# Altium project COMMS_ECU_revA.PrjPcb (part 3 of 3)

## Sheet LM74910H_PINOUT.SchDoc
size B; SheetNumber: 8; SheetTotal: 12
Used 2 times, as channels OR_0, OR_1. Parts and nets are listed once, with the designators drawn on the sheet.
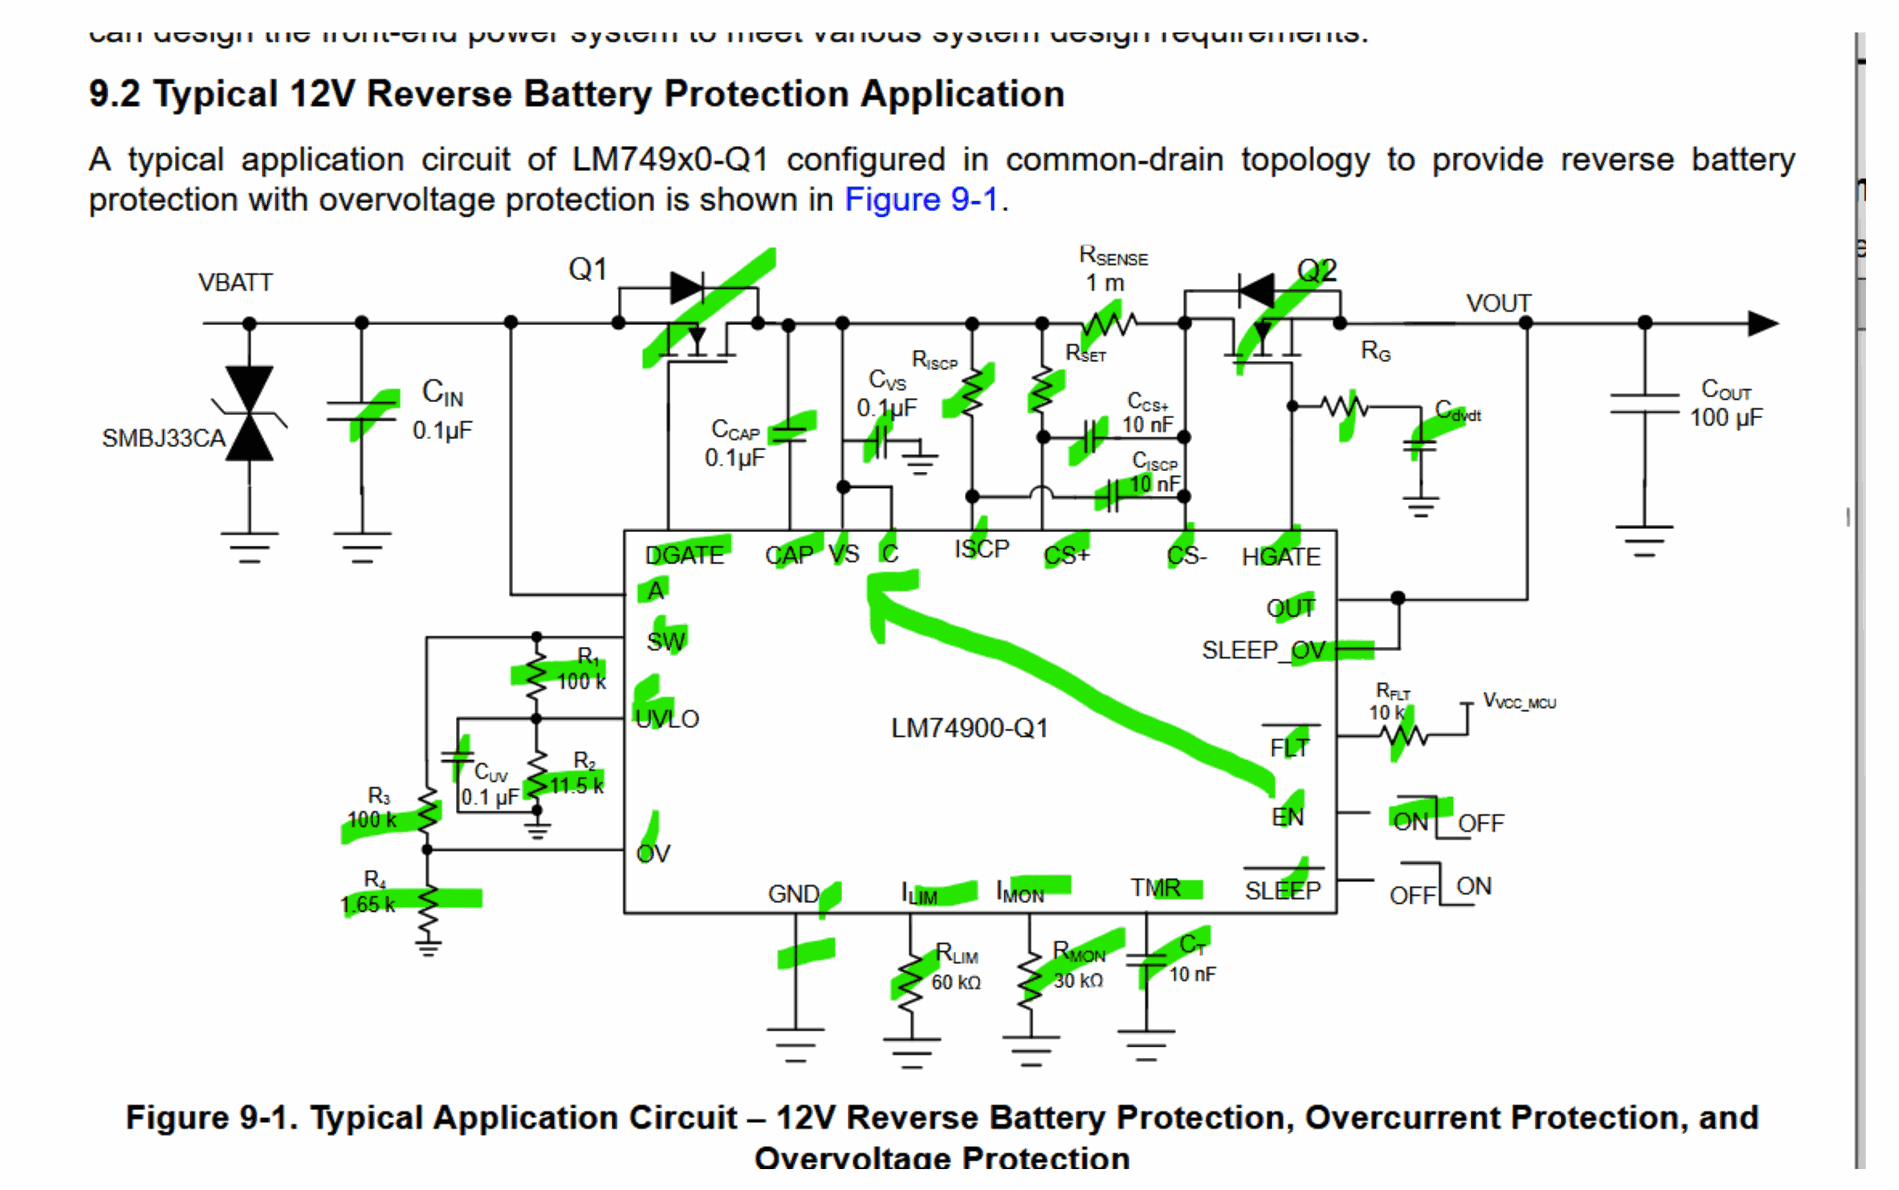
[diagram p13: LM74910H_PINOUT.SchDoc, top]
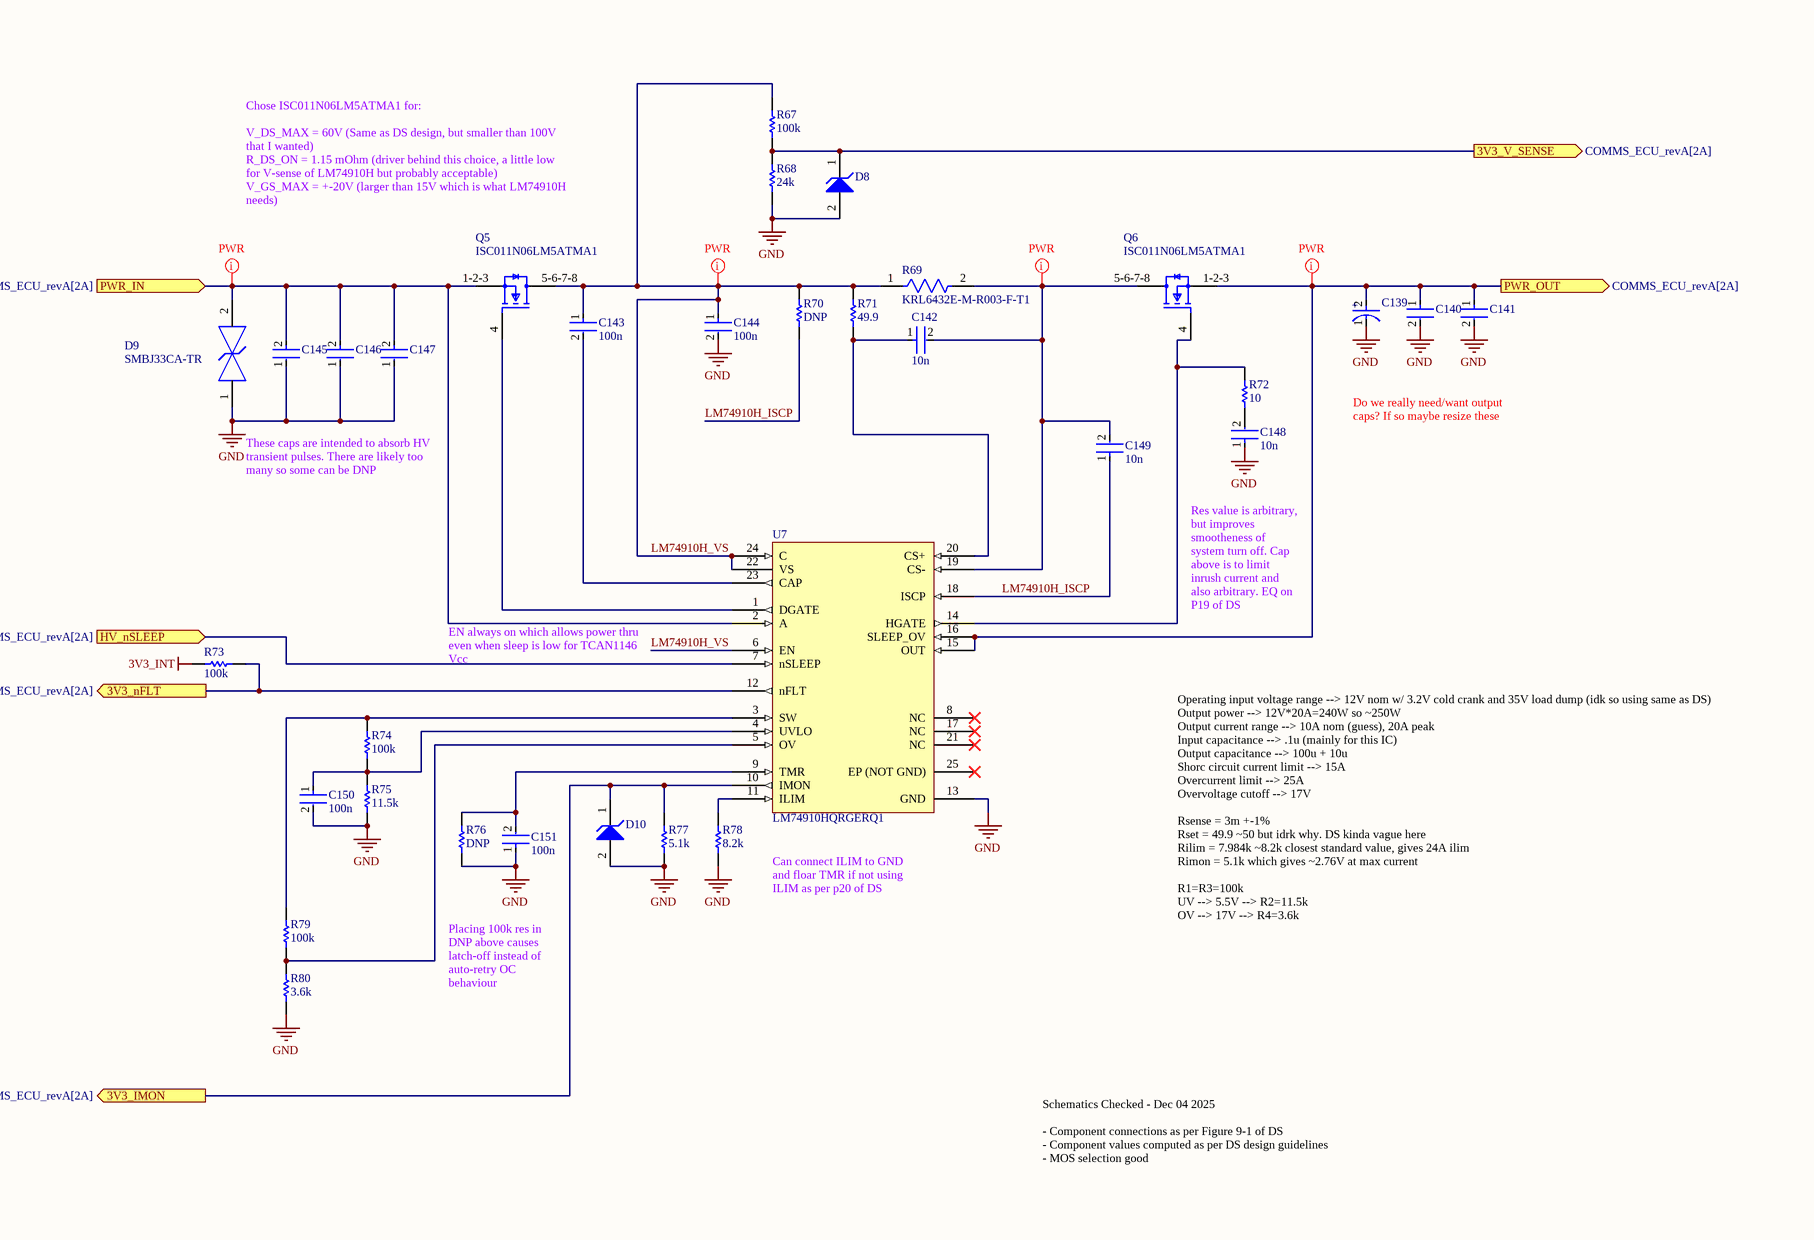
[diagram p14: LM74910H_PINOUT.SchDoc, bottom]

### Parts
C139  EEE-FK1H100UR  [FP-FKC-MFG]  (value not drawn)
C140  12103D106KAT2A  [FP-1210-L_3_3_0_4-W_2_5_0-MFG]  (value not drawn)
C141  12103D106KAT2A  [FP-1210-L_3_3_0_4-W_2_5_0-MFG]  (value not drawn)
C142  10n  [FP-0402-L_1_0_0_05-W_0_5-IPC_A]
C143  100n  [FP-0402-L_1_0_0_05-W_0_5-IPC_A]
C144  100n  [FP-0402-L_1_0_0_05-W_0_5-IPC_A]
C145  AC1210KKX7R0BB104  [FP-AC1210-0_85-MFG]  (value not drawn)
C146  AC1210KKX7R0BB104  [FP-AC1210-0_85-MFG]  (value not drawn)
C147  AC1210KKX7R0BB104  [FP-AC1210-0_85-MFG]  (value not drawn)
C148  10n  [FP-0402-L_1_0_0_05-W_0_5-IPC_A]
C149  10n  [FP-0402-L_1_0_0_05-W_0_5-IPC_A]
C150  100n  [FP-0402-L_1_0_0_05-W_0_5-IPC_A]
C151  100n  [FP-0402-L_1_0_0_05-W_0_5-IPC_A]
D8  DNP/MM5Z3V3T1G  [ONSC-SOD-523-2-502-01_V]  (value not drawn)
D9  SMBJ33CA-TR  [FP-SMB-CA-MFG]
D10  DNP/MM5Z3V3T1G  [ONSC-SOD-523-2-502-01_V]  (value not drawn)
Q5  ISC011N06LM5ATMA1  [FP-PG-TDSON-8-MFG]
Q6  ISC011N06LM5ATMA1  [FP-PG-TDSON-8-MFG]
R67  100k  [R0603B]
R68  24k  [R0603B]
R69  KRL6432E-M-R003-F-T1  [FP-KRL6432E-MFG]
R70  DNP  [R0603B]
R71  49.9  [R0603B]
R72  10  [R0603B]
R73  100k  [R0603B]
R74  100k  [R0603B]
R75  11.5k  [R0603B]
R76  DNP  [R0603B]
R77  5.1k  [R0603B]
R78  8.2k  [R0603B]
R79  100k  [R0603B]
R80  3.6k  [R0603B]
U7  LM74910HQRGERQ1  [QFN50P400X400X100_HS-25N]

### Ports
3V3_IMON (out, see COMMS_ECU_revA[2A]), 3V3_nFLT (out, see COMMS_ECU_revA[2A]), 3V3_V_SENSE (out, see COMMS_ECU_revA[2A]), HV_nSLEEP (in, see COMMS_ECU_revA[2A]), PWR_IN (in, see COMMS_ECU_revA[2A]), PWR_OUT (out, see COMMS_ECU_revA[2A])

### Nets
3V3_INT: R73.2
GND: C139.1(C) C140.2 C141.2 C144.2 C145.1 C146.1 C147.1 C148.1 C150.2 C151.1 D8.2(A) D9.1 D10.2(A) R68.1 R75.1 R76.1 R77.1 R78.1 R80.1 U7.13(GND)
3V3_IMON: D10.1(K) R77.2 U7.10(IMON) ; port 3V3_IMON
3V3_nFLT: R73.1 U7.12(nFLT) ; port 3V3_nFLT
3V3_V_SENSE: D8.1(K) R67.1 R68.2 ; port 3V3_V_SENSE
HV_nSLEEP: U7.7(nSLEEP) ; port HV_nSLEEP
LM74910H_ISCP: C149.1 R70.1 U7.18(ISCP)
LM74910H_VS: C143.1 C144.1 Q5.5-6-7-8(D) R67.2 R69.1 R70.2 R71.2 U7.6(EN) U7.22(VS) U7.24(C)
PWR_IN: C145.2 C146.2 C147.2 D9.2 Q5.1-2-3(S) U7.2(A) ; port PWR_IN
PWR_OUT: C139.2(A) C140.1 C141.1 Q6.1-2-3(S) U7.15(OUT) U7.16(SLEEP_OV) ; port PWR_OUT
NetC142_1: C142.1 R71.1 U7.20(CS+)
NetC142_2: C142.2 C149.2 Q6.5-6-7-8(D) R69.2 U7.19(CS-)
NetC143_2: C143.2 U7.23(CAP)
NetC148_2: C148.2 R72.1
NetC150_1: C150.1 R74.1 R75.2 U7.4(UVLO)
NetC151_2: C151.2 R76.2 U7.9(TMR)
NetQ5_4: Q5.4(G) U7.1(DGATE)
NetQ6_4: Q6.4(G) R72.2 U7.14(HGATE)
NetR74_2: R74.2 R79.2 U7.3(SW)
NetR78_2: R78.2 U7.11(ILIM)
NetR79_1: R79.1 R80.2 U7.5(OV)

Not connected (* = marked no-connect by the designer): U7 8(NC)* 17(NC)* 21(NC)* 25(EP_(NOT_GND))*

### Channels
OR_0: designators end in _OR_0; ports 3V3_IMON=3V3_CAR_VCC_I_SENSE 3V3_nFLT=3V3_CAR_OR_nFLT 3V3_V_SENSE=3V3_CAR_VCC_V_SENSE HV_nSLEEP=HV_PWR_EN PWR_IN=CAR_VCC PWR_OUT=PRE_VCC
OR_1: designators end in _OR_1; ports 3V3_IMON=3V3_CAR_APM_I_SENSE 3V3_nFLT=3V3_APM_OR_nFLT 3V3_V_SENSE=3V3_CAR_APM_V_SENSE HV_nSLEEP=HV_PWR_EN PWR_IN=APM_VCC PWR_OUT=PRE_VCC

### Layout directives
net class PWR: CAR_VCC, LM74910H_VS_OR_0, NetC142_OR_0_2, PRE_VCC

### Notes on the sheet
- Chose ISC011N06LM5ATMA1 for:
  V_DS_MAX = 60V (Same as DS design, but smaller than 100V that I wanted)
  R_DS_ON = 1.15 mOhm (driver behind this choice, a little low for V-sense of LM74910H but probably acceptable)
  V_GS_MAX = +-20V (larger than 15V which is what LM74910H needs)
- These caps are intended to absorb HV transient pulses. There are likely too many so some can be DNP
- Do we really need/want output caps? If so maybe resize these
- Res value is arbitrary, but improves smootheness of system turn off. Cap above is to limit inrush current and also arbitrary. EQ on P19 of DS
- EN always on which allows power thru even when sleep is low for TCAN1146 Vcc
- Can connect ILIM to GND and floar TMR if not using ILIM as per p20 of DS
- Placing 100k res in DNP above causes latch-off instead of auto-retry OC behaviour
- Operating input voltage range --> 12V nom w/ 3.2V cold crank and 35V load dump (idk so using same as DS)
  Output power --> 12V*20A=240W so ~250W
  Output current range --> 10A nom (guess), 20A peak
  Input capacitance --> .1u (mainly for this IC)
  Output capacitance --> 100u + 10u
  Shorc circuit current limit --> 15A
  Overcurrent limit --> 25A
  Overvoltage cutoff --> 17V
  Rsense = 3m +-1%
  Rset = 49.9 ~50 but idrk why. DS kinda vague here
  Rilim = 7.984k ~8.2k closest standard value, gives 24A ilim
  Rimon = 5.1k which gives ~2.76V at max current
  R1=R3=100k
  UV --> 5.5V --> R2=11.5k
  OV --> 17V --> R4=3.6k
- Schematics Checked - Dec 04 2025
  - Component connections as per Figure 9-1 of DS
  - Component values computed as per DS design guidelines
  - MOS selection good
- (in symbol CMP-05427-000030-1) +

### Library data of the parts
C139 = CMP-05427-000030-1: CAP ALUM 10UF 20% 50V SMD; Impedance: 1.52R; Ripple Current (AC): 85mA; Life (Hours): 2000Hour; Leakage Current: 3uA; Dielectric Material: Aluminium; Length: 5.8mm; Voltage Rating: 50V; Radiation Hardening: No; Max Operating Temperature: 105°C; REACH SVHC: No SVHC; Tolerance: 20%; RoHS Compliant: Yes; Case/Package: Radial; Height: 5.8mm; Voltage: 50V; Diameter: 5mm; Number of Pins: 2; Ripple Current: 85mA; Series: FK; Lead Free: Lead Free; Width: 6.5mm; ESR (Equivalent Series Resistance): 1.52R; Package Quantity: 1000; Construction: Cylindrical; Voltage Rating (DC): 50V; Packaging: Tape and Reel; Height - Seated (Max): 0.228inch; Contact Plating: Tin; Capacitance: 10uF; Min Operating Temperature: -55°C; Termination: SMD/SMT; Material: Aluminium; Mount: Surface Mount
C140 C141 = CMP-2000-05477-2: General Purpose Ceramic Capacitor, 1210, 10uF, 10%, X5R, 15%, 25V; Lead Free: Lead Free; Max Operating Temperature: 85°C; REACH SVHC: No SVHC; Depth: 2.5mm; Packaging: Tape and Reel; Min Operating Temperature: -55°C; Height: 2.29mm; Construction: Flat; Case Code (Imperial): 1210; Radiation Hardening: No; Voltage: 25V; Case/Package: 1210; Series: -; Dielectric: X5R; Length: 3.2mm; Thickness: 0.11inch; Package Quantity: 1; Termination: SMD/SMT; Case Code (Metric): 3225; Voltage Rating (DC): 25V; Voltage Rating: 25V; Contact Plating: Tin; RoHS Compliant: Yes; Mount: Surface Mount; Width: 0.098inch; Capacitance: 10uF; Tolerance: 10%
C142-C144 C148-C151 = CMP-001-00058-1: as C59-C102 on sheet SJA1105Q_PINOUT; Min Operating Temperature: -55°C; Mounting Technology: Surface Mount; Pins: 2; Case/Package: 0402; RoHS Compliant: Yes; Max Operating Temperature: 85°C
C145-C147 = CMP-03422-000642-1: CAP CER 0.1UF 100V X7R 1210; Manufacturer: Yageo; Automotive Grade: Grade 1; Capacitance: 100 nF; Material: Ceramic; Value: 100 nF; Temperature Coefficient: 15%; Tolerance: 0.1; Automotive: Yes; ComponentLink2Description: Datasheet; Device Class L2: Capacitors; Height: 0.95mm; Manufacturer Part Number: AC1210KKX7R0BB104; Temperature: -55°C to +125°C; Voltage Rating: 100 V; Device Class L1: Passive Components; ComponentLink2URL: http://www.yageo.com/documents/recent/UPY-AC_NP0X7R_16V-to-630V_12.pdf; Lead Free: Yes; Category: Cap; Temperature Range High: +125°C; RoHS: TRUE; Digikey Description: CAP CER 0.1UF 100V X7R 1210; Temperature Range Low: -55°C; Octopart: https://octopart.com/ac1210kkx7r0bb104-yageo-78873719; Device Class L3: Ceramic Capacitors; Ipc Land Pattern Name: CAPC320250X85; Package: AC1210-0.85; Footprint Url: http://www.yageo.com/exep/pages/download/literatures/UPY-C_GEN_24.pdf; Temperature Characteristic: X7R
D8 D10 = CMP-1060-00750-1: Zener Voltage Regulator, 500 mW, 2-Pin SOD-523, Pb-Free, Tape and Reel; Manufacturer: On Semiconductor; P Max (W): 0.5; VZ Typ (V): 3.3; RoHS: Pb-Free; ComponentLink2Description: Datasheet; PackageReference: SOD-523-2-502-01; DatasheetVersion: Rev. 10; ComponentLink1Description: Manufacturer URL; PackageVersion: Rev. E, 09/2010; ComponentLink3URL: http://www.onsemi.com/pub_link/Collateral/502-01.PDF; ComponentLink2URL: http://www.onsemi.cn/pub_link/Collateral/MM5Z2V4T1-D.PDF; Mounting Technology: Surface Mount; PartNumber: MM5Z3V3T1G; Packing: Tape and Reel; PackageDescription: 2-Pin SOD, Body 1.2 x 0.8 mm; ComponentLink1URL: http://www.onsemi.com/; ComponentLink3Description: Package Specification
D9 = CMP-12225-000040-1: TVS DIODE 33V 69.7V SMB; Manufacturer: STMicroelectronics; Direction: Bidirectional; Peak Pulse Current: 11.8A; Peak Pulse Power: 600W; Clamping Voltage: 53.3V; Breakdown Voltage: 36.7V; Number Of Channels: 1; Standoff Height: 0.05mm; Max Junction Temp: +150°C; Lead Free: Yes; Device Class L1: Circuit Protection; Device Class L3: unset; Mouser Description: TVS Diodes - Transient Voltage Suppressors 600W 33V Bidirect; Device Class L2: TVS Diodes; Temperature Range High: +150°C; Temperature: -55°C to +150°C; Temperature Range Low: -55°C; Octopart: https://octopart.com/smbj33ca-tr-stmicroelectronics-347069; Manufacturer Part Number: SMBJ33CA-TR; Automotive: No; ComponentLink2URL: https://www.st.com/resource/en/datasheet/smbj.pdf; RoHS: TRUE; Package: SMB-CA; Category: Diode; ComponentLink2Description: Datasheet; Height: 2.65mm; Reverse Standoff Voltage: 33V; Digikey Description: TVS DIODE 33V 69.7V SMB
Q5 Q6 = CMP-32901-001049-1: TRENCH 40<-<100V PG-TDSON-8
R67 R68 R70-R80 = CMP-009-00002-14: Resistor
R69 = CMP-00597-24927456-1: KRL6432E-M-R003-F-T1 Metal Foil Low Resistance Chip Resistor (long-side terminal), 2512, RoHS; Tolerance: 1%; Resistance: 3mΩ; Temperature Coefficient: 50ppm/°C; Power Rating: 3W; Height: 700µm; NexarPartId: 24927456; Termination: SMD/SMT; Case Code (Metric): 6432; Min Operating Temperature: -55°C; Length: 3.1mm; Weight: 40.511469mg; Width: 6.3mm; Lifecycle Status: Production; Max Operating Temperature: 155°C; Case Code (Imperial): 2512; Composition: Metal Foil; Case/Package: 2512; Max Thickness: 700µm; RoHS: Compliant
U7 = CMP-019-00057-2: Automotive ideal diode with circuit breaker, 200-kHz ACS, UV , OV protection and SLEEP mode 24-VQFN -40 to 125; Pins: 24; Case/Package: VQFN

## Sheet INPUT_PWR_SW.SchDoc
size B; SheetNumber: 7; SheetTotal: 13
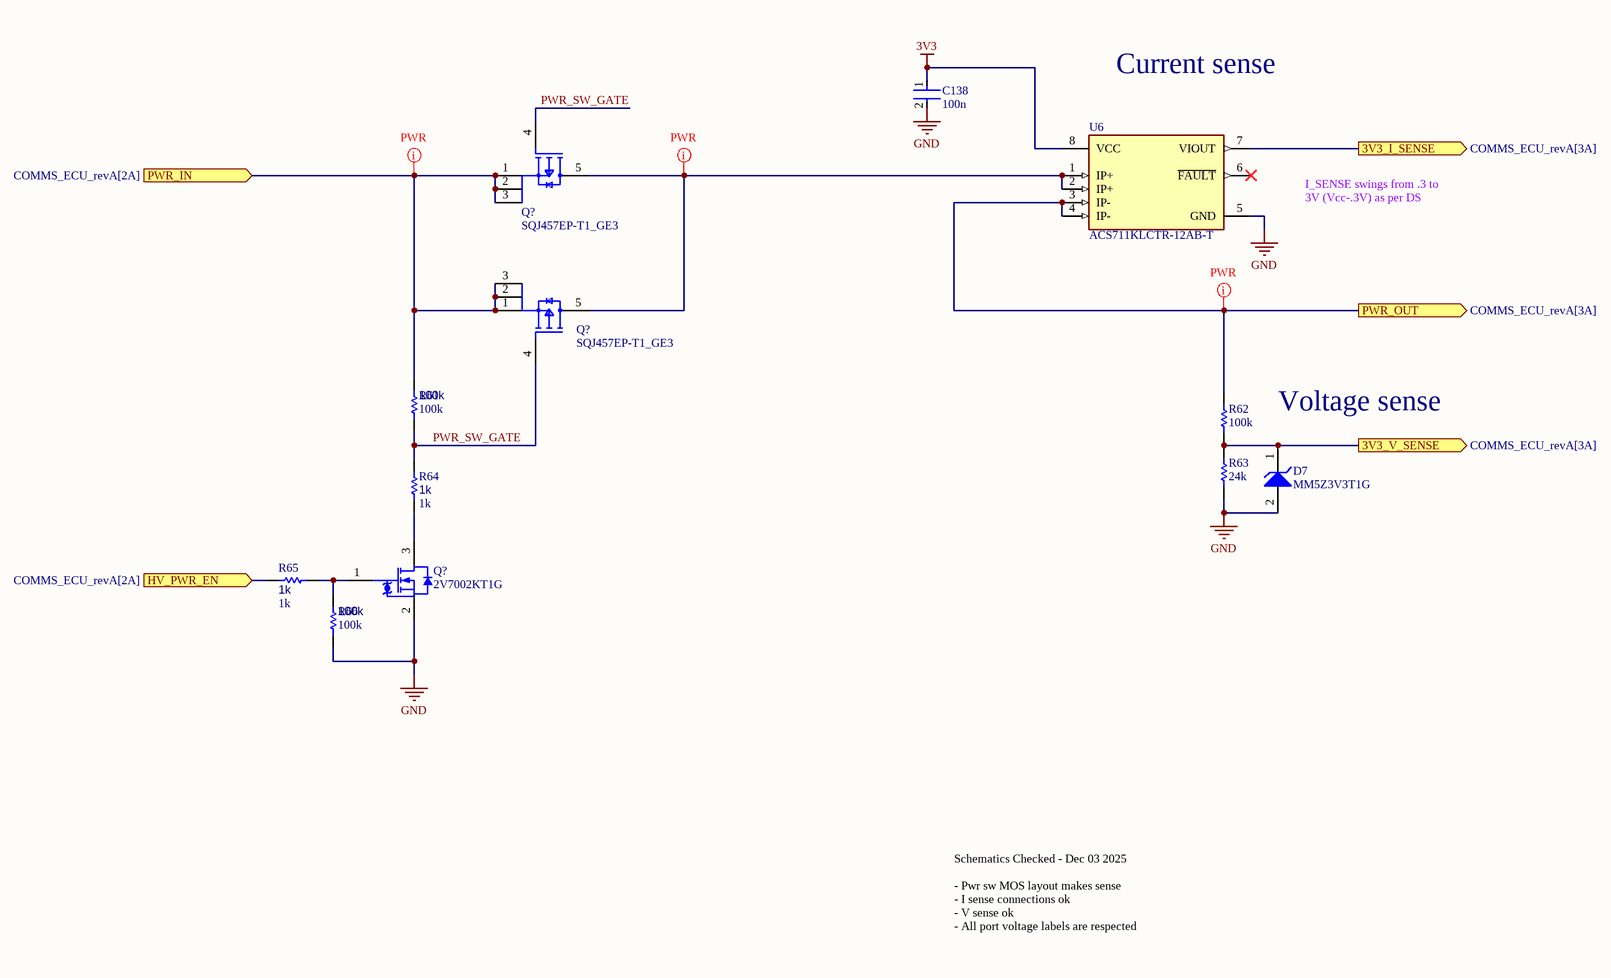
[diagram p15: INPUT_PWR_SW.SchDoc]

### Parts
(Parts that share a designator on the sheet are numbered #1, #2 ... from top to bottom, then left to right.)
C138  100n  [FP-0402-L_1_0_0_05-W_0_5-IPC_A]
D7  MM5Z3V3T1G  [ONSC-SOD-523-2-502-01_V]
Q?#1  SQJ457EP-T1_GE3  [FP-C15-1203-SINGLE-MFG]
Q?#2  SQJ457EP-T1_GE3  [FP-C15-1203-SINGLE-MFG]
Q?#3  2V7002KT1G  [ONSC-SOT-23-3-318-08_V]
R61  100k  [R0603B]
R62  100k  [R0603B]
R63  24k  [R0603B]
R64  1k  [R0603B]
R65  1k  [R0603B]
R66  100k  [R0603B]
U6  ACS711KLCTR-12AB-T  [FP-LC-8-IPC_C]

### Ports
3V3_I_SENSE (out, see COMMS_ECU_revA[3A]), 3V3_V_SENSE (out, see COMMS_ECU_revA[3A]), HV_PWR_EN (in, see COMMS_ECU_revA[2A]), PWR_IN (in, see COMMS_ECU_revA[2A]), PWR_OUT (out, see COMMS_ECU_revA[3A])

### Nets
3V3: C138.1 U6.8(VCC)
GND: C138.2 D7.2(A) Q?#3.2(S) R63.1 R66.1 U6.5(GND)
PRE_VCC: Q?#1.1(S) Q?#1.2(S) Q?#1.3(S) Q?#2.1(S) Q?#2.2(S) Q?#2.3(S) R61.2 ; port PWR_IN
VCC: R62.2 U6.3(IP-) U6.4(IP-) ; port PWR_OUT
3V3_INPUT_I_SENSE: U6.7(VIOUT) ; port 3V3_I_SENSE
3V3_INPUT_V_SENSE: D7.1(K) R62.1 R63.2 ; port 3V3_V_SENSE
HV_PWR_EN: R65.1 ; port HV_PWR_EN
PWR_SW_GATE: Q?#1.4(G) Q?#2.4(G) R61.1 R64.2
NetQ?#1_5: Q?#1.5(D) Q?#2.5(D) U6.1(IP+) U6.2(IP+)
NetQ?#3_1: Q?#3.1(G) R65.2 R66.2
NetQ?#3_3: Q?#3.3(D) R64.1

Not connected (* = marked no-connect by the designer): U6 6(~{FAULT})*

### Layout directives
net class PWR: NetQ?#1_5, PRE_VCC, VCC

### Notes on the sheet
- Current sense
- I_SENSE swings from .3 to 3V (Vcc-.3V) as per DS
- Voltage sense
- Schematics Checked - Dec 03 2025
  - Pwr sw MOS layout makes sense
  - I sense connections ok
  - V sense ok
  - All port voltage labels are respected

### Library data of the parts
C138 = CMP-001-00058-1: LARGE PADS, 0402 CAP, CHANGE COMMENT TO MATCH REAL P/N; Capacitor Type: Ceramic; Min Operating Temperature: -55°C; Mounting Technology: Surface Mount; Pins: 2; Case/Package: 0402; RoHS Compliant: Yes; Max Operating Temperature: 85°C
D7 = CMP-1060-00750-1: Zener Voltage Regulator, 500 mW, 2-Pin SOD-523, Pb-Free, Tape and Reel; Manufacturer: On Semiconductor; P Max (W): 0.5; VZ Typ (V): 3.3; RoHS: Pb-Free; ComponentLink2Description: Datasheet; PackageReference: SOD-523-2-502-01; DatasheetVersion: Rev. 10; ComponentLink1Description: Manufacturer URL; PackageVersion: Rev. E, 09/2010; ComponentLink3URL: http://www.onsemi.com/pub_link/Collateral/502-01.PDF; ComponentLink2URL: http://www.onsemi.cn/pub_link/Collateral/MM5Z2V4T1-D.PDF; Mounting Technology: Surface Mount; PartNumber: MM5Z3V3T1G; Packing: Tape and Reel; PackageDescription: 2-Pin SOD, Body 1.2 x 0.8 mm; ComponentLink1URL: http://www.onsemi.com/; ComponentLink3Description: Package Specification
Q?#1 Q?#2 = CMP-02550-000177-1: MOSFET P-CH 60V 36A POWERPAKSO-8; Manufacturer: Vishay; Gate Charge At Vgs: 65nC @ -10V; Rthja Max: 68°C/W; Number Of P Channels: 1; Continuous Drain Current: -36A; Drain To Source Resistance: 0.021Ω; Depletion Mode: False; Threshold Vgs Max: -2.5V; Max Junction Temp: +175°C; Power Dissipation: 68W; Turn Off Delay Time: 40ns; Automotive Grade: Grade 0; Max Forward Diode Voltage: -1.2V; Pulse Drain Current: -100A; Gate To Source Voltage: 20V; Typ Forward Diode Voltage: -0.8V; Drain To Source Voltage: -60V; Standoff Height: 0mm; Transconductance: 26S; Turn On Delay Time: 15ns; Threshold Vgs Min: -1.5V; Input Capacitace At Vds: 2600pF @ -25V; Digikey Description: MOSFET P-CH 60V 36A POWERPAKSO-8; Temperature Range High: +175°C; Device Class L3: MOSFETs; Lead Free: Yes; ComponentLink2URL: http://www.vishay.com/docs/76628/sqj457ep.pdf; Mouser Description: Trans MOSFET P-CH 60V 36A Automotive 5-Pin(4+Tab) PowerPAK SO T/R; Package: C15-1203-SINGLE; ComponentLink2Description: Datasheet; RoHS: TRUE; Number Of Channels: 1; Drain To Source Breakdown Voltage: -60V; Automotive: Yes; Height: 1.267mm; Device Class L1: Discrete Semiconductors; Temperature: -55°C to +175°C; Temperature Range Low: -55°C; Category: Trans; Manufacturer Part Number: SQJ457EP-T1_GE3; Octopart: https://octopart.com/sqj457ep-t1_ge3-vishay-76967335; Device Class L2: Transistors
Q?#3 = CMP-1058-00784-1: Small Signal MOSFET, 60 V, 380 mA, Single, N-Channel, 3-Pin SOT-23, Pb-Free, Tape and Reel; Manufacturer: On Semiconductor; ID Max (A): 0.38; V(BR)DSS Min (V): 60; Coss Typ (pF): 4.2; VGS(th) Max (V): 2.3; Crss Typ (pF): 2.2; VGS Max (V): 20; Channel Polarity: N Channel; Ciss Typ (pF): 24.5; ComponentLink3URL: http://www.onsemi.cn/pub_link/Collateral/318-08.PDF; ComponentLink1Description: Manufacturer URL; Configuration: Single; Mounting Technology: Surface Mount; ComponentLink3Description: Package Specification; DatasheetVersion: Rev. 11; Packing: Tape and Reel; PackageVersion: Rev. AP, 11/2009; PackageReference: SOT-23-3-318-08; Package Type: SOT-23-3; ComponentLink2URL: http://www.onsemi.com/pub_link/Collateral/2N7002K-D.PDF; ComponentLink2Description: Datasheet; RoHS: Pb-Free; PackageDescription: 3-Pin Small Outline Transistor, Body 2.92 x 1.3 mm, Pitch 0.95 mm; ComponentLink1URL: http://www.onsemi.com/; PartNumber: 2V7002KT1G
R61-R66 = CMP-009-00002-14: Resistor
  R61 R62 R66: Value: 100k
  R63: Value: 24k
  R64 R65: Value: 1k
U6 = CMP-1557-00012-2: SENSOR CURRENT HALL 12.5A AC/DC; Number of Channels: 1; Min Supply Voltage: 3V; Sensitivity: 110mV/A; Response Time: 4.6us; Operating Supply Voltage: 3.3V; Max Supply Voltage: 5.5V; Max Supply Current: 5.5mA; Bandwidth: 100kHz; Linearity: 1%; Quiescent Current: 4mA; Accuracy: 5%; Polarity: Bidirectional; Case/Package: SOIC; Packaging: Tape and Reel; Number of Pins: 8; Width: 3.9mm; Frequency: 100kHz; -3db Bandwidth: 100kHz; REACH SVHC: No SVHC; Series: -; Height: 1.5mm; Package Quantity: 1; Min Operating Temperature: -40°C; Max Operating Temperature: 125°C; Current Sensing: 12.5A; RoHS Compliant: Yes; Length: 4.9mm

## Sheet LM61495Q3_PINOUT.SchDoc
size A4; SheetNumber: 10; SheetTotal: 12
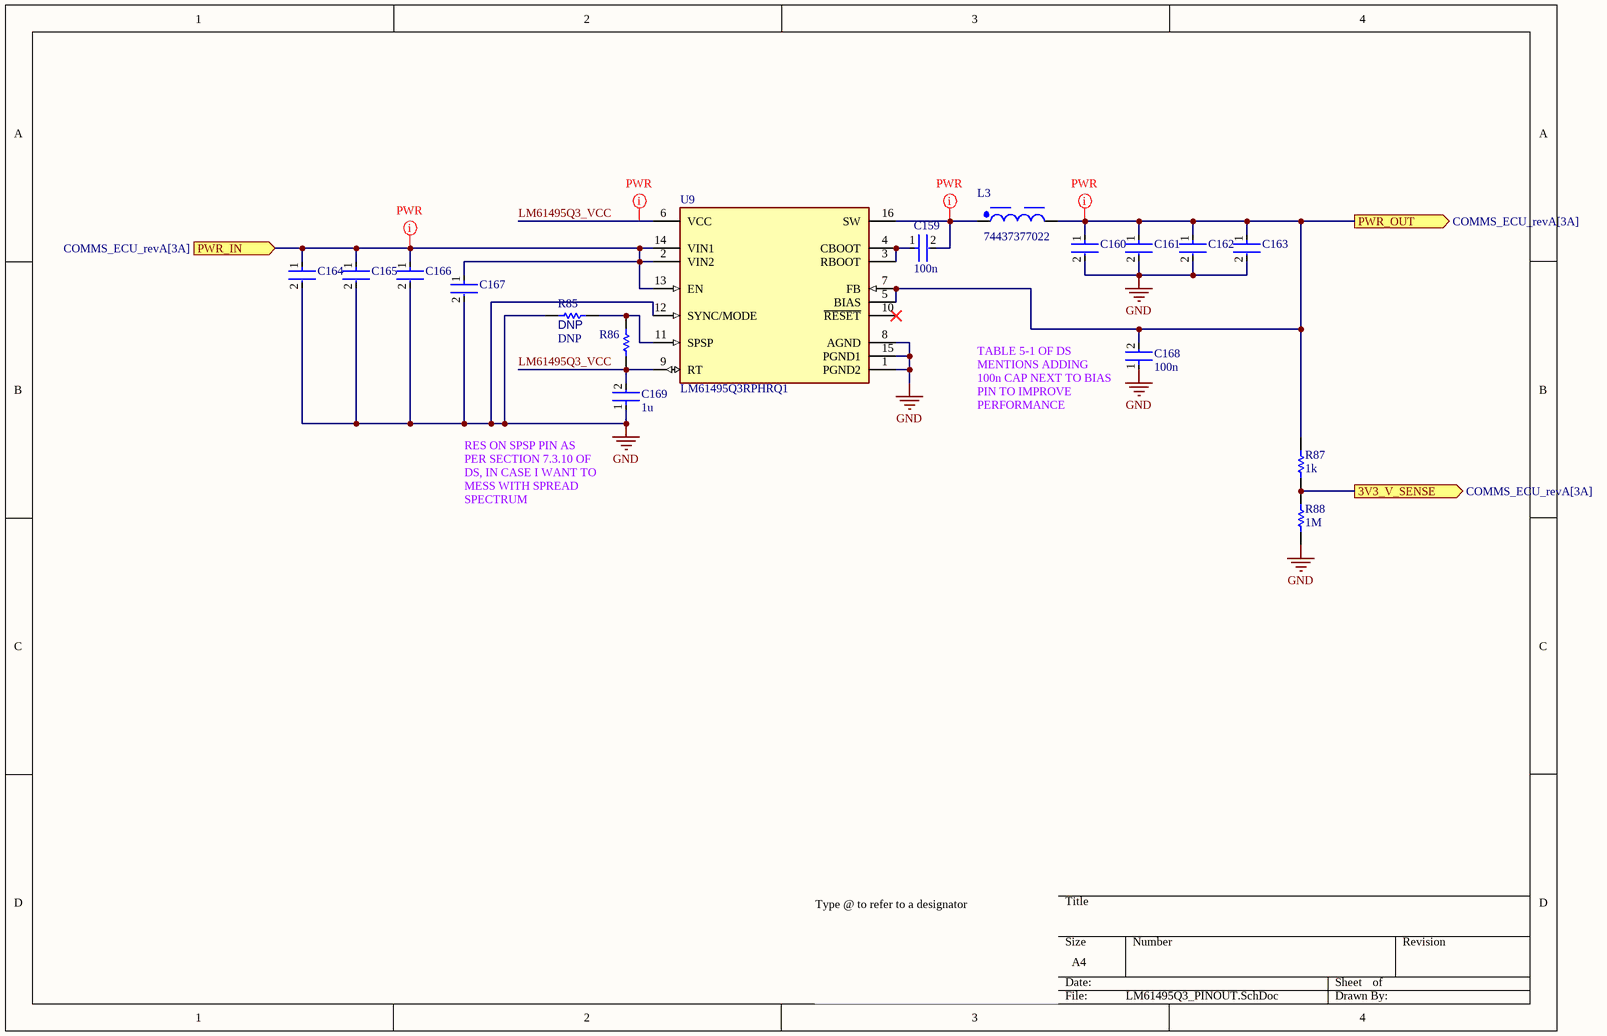
[diagram p16: LM61495Q3_PINOUT.SchDoc]

### Parts
C159  100n  [FP-0402-L_1_0_0_05-W_0_5-IPC_A]
C160  GRM32ER61C476KE15L  [FP-GRM32E-0_3-0_2-IPC_C]  (value not drawn)
C161  GRM32ER61C476KE15L  [FP-GRM32E-0_3-0_2-IPC_C]  (value not drawn)
C162  GRM32ER61C476KE15L  [FP-GRM32E-0_3-0_2-IPC_C]  (value not drawn)
C163  DNP  [FP-GRM32E-0_3-0_2-IPC_C]  (value not drawn)
C164  C3225X7R1H106M250AC  [FP-C3225-250-0_4-MFG]  (value not drawn)
C165  C3225X7R1H106M250AC  [FP-C3225-250-0_4-MFG]  (value not drawn)
C166  08055C474J4Z2A  [FP-0805-L_2_01_0_2-W_1_25-IPC_B]  (value not drawn)
C167  08055C474J4Z2A  [FP-0805-L_2_01_0_2-W_1_25-IPC_B]  (value not drawn)
C168  100n  [FP-0402-L_1_0_0_05-W_0_5-IPC_A]
C169  1u  [FP-0402-L_1_0_0_05-W_0_5-IPC_A]
L3  74437377022  [WE-LHMI_1335]
R85  DNP  [R0603B]
R86  0402 JUMPER  [RESC1005X40X25ML05T05]  (value not drawn)
R87  1k  [R0603B]
R88  1M  [R0603B]
U9  LM61495Q3RPHRQ1  [FP-RPH0016A-MFG]

### Ports
3V3_V_SENSE (out, see COMMS_ECU_revA[3A]), PWR_IN (in, see COMMS_ECU_revA[3A]), PWR_OUT (out, see COMMS_ECU_revA[3A])

### Nets
3V3: C160.1 C161.1 C162.1 C163.1 C168.2 L3.2 R87.2 U9.5(BIAS) U9.7(FB) ; port PWR_OUT
GND: C160.2 C161.2 C162.2 C163.2 C164.2 C165.2 C166.2 C167.2 C168.1 C169.1 R85.2 R88.1 U9.1(PGND2) U9.8(AGND) U9.12(SYNC/MODE) U9.15(PGND1)
VCC: C164.1 C165.1 C166.1 C167.1 U9.2(VIN2) U9.13(EN) U9.14(VIN1) ; port PWR_IN
3V3_3V3_MAIN_V_SENSE: R87.1 R88.2 ; port 3V3_V_SENSE
LM61495Q3_VCC: C169.2 R86.1 U9.6(VCC) U9.9(RT)
NetC159_1: C159.1 U9.3(RBOOT) U9.4(CBOOT)
NetC159_2: C159.2 L3.1 U9.16(SW)
NetR85_1: R85.1 R86.2 U9.11(SPSP)

Not connected (* = marked no-connect by the designer): U9 10(~{RESET})*

### Layout directives
net class PWR: 3V3, LM61495Q3_VCC, NetC159_2, VCC

### Notes on the sheet
- (near C168) TABLE 5-1 OF DS MENTIONS ADDING 100n CAP NEXT TO BIAS PIN TO IMPROVE PERFORMANCE
- (near C169) RES ON SPSP PIN AS PER SECTION 7.3.10 OF DS, IN CASE I WANT TO MESS WITH SPREAD SPECTRUM
- Type @ to refer to a designator

### Library data of the parts
C159 C168 C169 = CMP-001-00058-1: as C138 on sheet INPUT_PWR_SW; Min Operating Temperature: -55°C; Mounting Technology: Surface Mount; Pins: 2; Case/Package: 0402; RoHS Compliant: Yes; Max Operating Temperature: 85°C
C160-C163 = CMP-2000-06362-2: CAP CER 47UF 16V X5R 1210; Tolerance: 10%; Material: Ceramic; Case Code (Metric): 3225; RoHS Compliant: Yes; Min Operating Temperature: -55°C; Radiation Hardening: No; Voltage: 16V; Package Quantity: 1; Case Code (Imperial): 1210; REACH SVHC: No SVHC; Capacitance: 47uF; Voltage Rating (DC): 16V; Dielectric: X5R; Case/Package: 1210; Length: 3.2mm; Voltage Rating: 16V; Packaging: Cut Tape; Width: 0.098inch; Number of Pins: 2; Lead Free: Lead Free; Height: 2.5mm; Mount: Surface Mount; Termination: SMD/SMT; Max Operating Temperature: 85°C; Thickness: 0.106inch; Depth: 2.5mm
C164 C165 = CMP-08246-002653-1: Multilayer Ceramic Capacitors 10uF ±20% 50V X7R SMD 1210; Width: 0.098inch; Package Quantity: 1000; Height: 2.5mm; Dielectric Material: Ceramic; Voltage Rating: 50V; Series: C; Capacitance: 10uF; Tolerance: 20%; Weight: 0.000564oz; Case/Package: 1210; Case Code (Imperial): 1210; Dielectric: X7R; Case Code (Metric): 3225; REACH SVHC: No SVHC; Packaging: Tape and Reel; Length: 0.126inch; Termination: SMD/SMT; Min Operating Temperature: -55°C; Voltage Rating (DC): 50V; Lead Free: Lead Free; Max Operating Temperature: 125°C; Thickness: 0.11inch; Mount: Surface Mount
C166 C167 = CMP-04427-003155-1: Automotive Ceramic Capacitor, 0805, 470nF, 5%, X7R, 15%, 50V; Dielectric: X7R; Depth: 1.25mm; Max Operating Temperature: 125°C; Mount: Surface Mount; Radiation Hardening: No; Capacitance: 470nF; Construction: Flat; Packaging: Tape and Reel; Min Operating Temperature: -55°C; Length: 2.01mm; RoHS Compliant: Yes; Voltage Rating (DC): 50V; Case/Package: 0805; Tolerance: 5%; Package Quantity: 2000
L3 = CMP-1353-00019-6: Inductor Power Shielded/Molded Wirewound 2.2uH 20% 100KHz Powdered Iron 10A 0.008Ohm DCR T/R Automotive AEC-Q200; Series Resistance: 8mΩ; DC Resistance (DCR): 7.2mΩ; Inductance: 2.2µH; Saturation Current: 14.2A; Core Material: Composite, Ferrite; Frequency: 22MHz; Mount: Surface Mount; Ambient Temperature Range Low: -40°C; Max DC Current: 10A; Depth: 12.6mm; Height: 3.3mm; Tolerance: 20%; REACH SVHC: Unknown; Width: 12.6mm; Max Operating Temperature: 125°C; Height - Seated (Max): 3.5052mm; Composition: Wirewound; Inductance Tolerance: 20%; Length: 13.5mm; RMS Current (Irms): 10A; Termination: SMD/SMT; Test Frequency: 100kHz; Current Rating: 10A; Case/Package: Nonstandard; Shielding: Shielded; Ambient Temperature Range High: 85°C; Min Operating Temperature: -40°C; Self Resonant Frequency: 22MHz; RoHS: Compliant
R85 R87 R88 = CMP-009-00002-14: Resistor
  R85: Value: DNP
  R87: Value: 1k
  R88: Value: 1M
R86 = CMP-009-00118-2: READ THE NAME; Pins: 2; Component Type: Standard; Design Item ID: CMP-009-00206-2; Source: 0402jump.SchLib
U9 = CMP-04918-000675-1: 10-A AUTOMOTIVE BUCK CONVERTER O

## Sheet AP64502Q_PINOUT.SchDoc
size A; SheetNumber: 12; SheetTotal: 12
Used 2 times, as channels REG_3, REG_2. Parts and nets are listed once, with the designators drawn on the sheet.
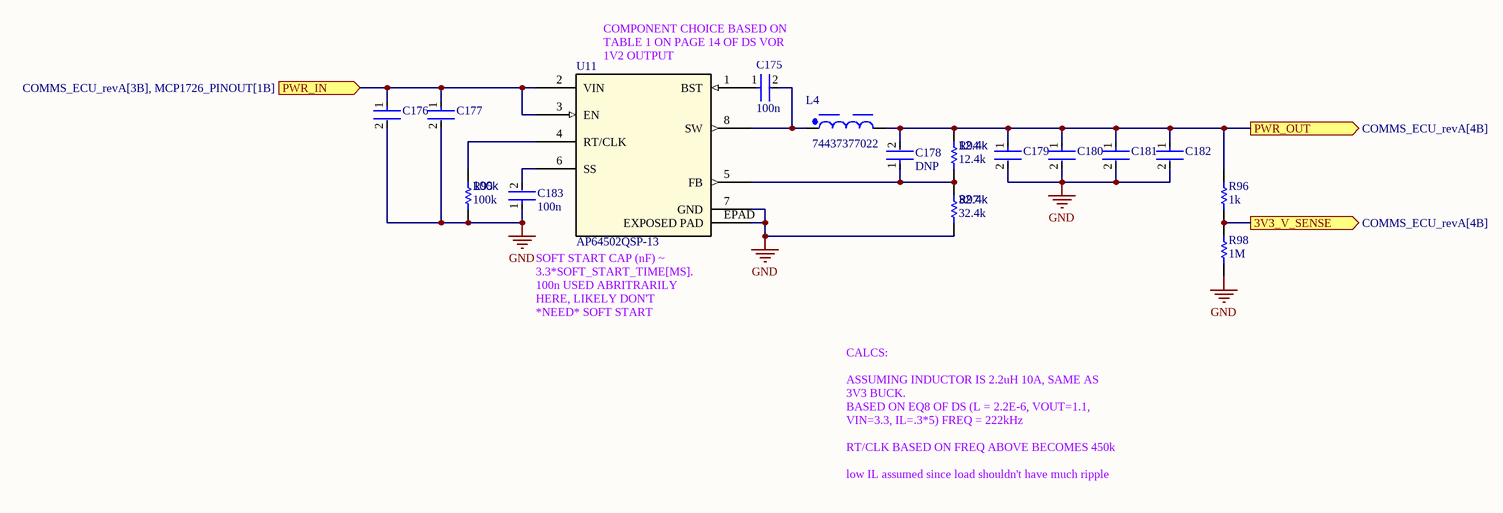
[diagram p17: AP64502Q_PINOUT.SchDoc]

### Parts
C175  100n  [FP-0402-L_1_0_0_05-W_0_5-IPC_A]
C176  12103D106KAT2A  [FP-1210-L_3_3_0_4-W_2_5_0-MFG]  (value not drawn)
C177  12103D106KAT2A  [FP-1210-L_3_3_0_4-W_2_5_0-MFG]  (value not drawn)
C178  DNP  [FP-0402-L_1_0_0_05-W_0_5-IPC_A]
C179  CGA9N3X7R1C476M230KB  [FP-CGA9P-IPC_A]  (value not drawn)
C180  CGA9N3X7R1C476M230KB  [FP-CGA9P-IPC_A]  (value not drawn)
C181  CGA9N3X7R1C476M230KB  [FP-CGA9P-IPC_A]  (value not drawn)
C182  DNP  [FP-CGA9P-IPC_A]  (value not drawn)
C183  100n  [FP-0402-L_1_0_0_05-W_0_5-IPC_A]
L4  74437377022  [WE-LHMI_1335]
R94  12.4k  [R0603B]
R95  100k  [R0603B]
R96  1k  [R0603B]
R97  32.4k  [R0603B]
R98  1M  [R0603B]
U11  AP64502QSP-13  [SOIC127P600X163_HS-9N]

### Ports
3V3_V_SENSE (out, see COMMS_ECU_revA[4B]), PWR_IN (in, see COMMS_ECU_revA[3B], MCP1726_PINOUT[1B]), PWR_OUT (out, see COMMS_ECU_revA[4B])

### Nets
GND: C176.2 C177.2 C179.2 C180.2 C181.2 C182.2 C183.1 R95.1 R97.1 R98.1 U11.7(GND) U11.EPAD(EXPOSED_PAD)
3V3_V_SENSE: R96.1 R98.2 ; port 3V3_V_SENSE
PWR_IN: C176.1 C177.1 U11.2(VIN) U11.3(EN) ; port PWR_IN
PWR_OUT: C178.2 C179.1 C180.1 C181.1 C182.1 L4.2 R94.2 R96.2 ; port PWR_OUT
NetC175_1: C175.1 U11.1(BST)
NetC175_2: C175.2 L4.1 U11.8(SW)
NetC178_1: C178.1 R94.1 R97.2 U11.5(FB)
NetC183_2: C183.2 U11.6(SS)
NetR95_2: R95.2 U11.4(RT/CLK)

### Channels
REG_3: ports 3V3_V_SENSE=3V3_1V1_MAIN_V_SENSE PWR_IN=VCC PWR_OUT=1V1
REG_2: designators end in _REG_2; ports 3V3_V_SENSE=3V3_1V2_MAIN_V_SENSE PWR_IN=VCC PWR_OUT=1V2

### Notes on the sheet
- COMPONENT CHOICE BASED ON TABLE 1 ON PAGE 14 OF DS VOR 1V2 OUTPUT
- (near U11) SOFT START CAP (nF) ~ 3.3*SOFT_START_TIME[MS]. 100n USED ABRITRARILY HERE, LIKELY DON'T *NEED* SOFT START
- CALCS:
  ASSUMING INDUCTOR IS 2.2uH 10A, SAME AS 3V3 BUCK.
  BASED ON EQ8 OF DS (L = 2.2E-6, VOUT=1.1, VIN=3.3, IL=.3*5) FREQ = 222kHz
  RT/CLK BASED ON FREQ ABOVE BECOMES 450k
  low IL assumed since load shouldn't have much ripple

### Library data of the parts
C175 C178 C183 = CMP-001-00058-1: as C138 on sheet INPUT_PWR_SW; Min Operating Temperature: -55°C; Mounting Technology: Surface Mount; Pins: 2; Case/Package: 0402; RoHS Compliant: Yes; Max Operating Temperature: 85°C
C176 C177 = CMP-2000-05477-2: General Purpose Ceramic Capacitor, 1210, 10uF, 10%, X5R, 15%, 25V; Lead Free: Lead Free; Max Operating Temperature: 85°C; REACH SVHC: No SVHC; Depth: 2.5mm; Packaging: Tape and Reel; Min Operating Temperature: -55°C; Height: 2.29mm; Construction: Flat; Case Code (Imperial): 1210; Radiation Hardening: No; Voltage: 25V; Case/Package: 1210; Series: -; Dielectric: X5R; Length: 3.2mm; Thickness: 0.11inch; Package Quantity: 1; Termination: SMD/SMT; Case Code (Metric): 3225; Voltage Rating (DC): 25V; Voltage Rating: 25V; Contact Plating: Tin; RoHS Compliant: Yes; Mount: Surface Mount; Width: 0.098inch; Capacitance: 10uF; Tolerance: 10%
C179-C182 = CMP-08246-000988-1: Cap Ceramic 47uF 16V X7R 20% Pad SMD 2220 +125°C Automotive T/R; Length: 5.7mm; Packaging: Tape and Reel; Width: 5mm; Case Code (Imperial): 2220; Thickness: 0.091inch; Lead Free: Lead Free; Capacitance: 47uF; Voltage Rating (DC): 16V; Mount: Surface Mount; Composition: Ceramic; Termination: SMD/SMT; Ratings: AEC-Q200; Case/Package: 2220; Weight: 0.016932oz; REACH SVHC: No SVHC; Voltage Rating: 16V; Max Operating Temperature: 125°C; Case Code (Metric): 5750; Package Quantity: 1; Min Operating Temperature: -55°C; Depth: 5mm; Height: 2.3mm; Tolerance: 20%; Dielectric: X7R
L4 = CMP-1353-00019-6: as L3 on sheet LM61495Q3_PINOUT; Mount: Surface Mount; Ambient Temperature Range Low: -40°C; Max DC Current: 10A; Depth: 12.6mm; Height: 3.3mm; Tolerance: 20%; REACH SVHC: Unknown; Width: 12.6mm; Max Operating Temperature: 125°C; Height - Seated (Max): 3.5052mm; Composition: Wirewound; Inductance Tolerance: 20%; Length: 13.5mm; RMS Current (Irms): 10A; Termination: SMD/SMT; Test Frequency: 100kHz; Current Rating: 10A; Case/Package: Nonstandard; Shielding: Shielded; Ambient Temperature Range High: 85°C; Min Operating Temperature: -40°C; Self Resonant Frequency: 22MHz; RoHS: Compliant
R94-R98 = CMP-009-00002-14: Resistor
  R94: Value: 12.4k
  R95: Value: 100k
  R96: Value: 1k
  R97: Value: 32.4k
  R98: Value: 1M
U11 = CMP-019-00063-1: DC-DC Switching Synchronous Buck Regulator, Adjustable, 3.8-40 V in, 0.8-40 V out, 3 A out, HSOIC-8; Max Supply Voltage: 40V; Max Operating Temperature: 125°C; Min Operating Temperature: -40°C

## Sheet INT_REG.SchDoc
size A4; SheetNumber: 13; SheetTotal: 13
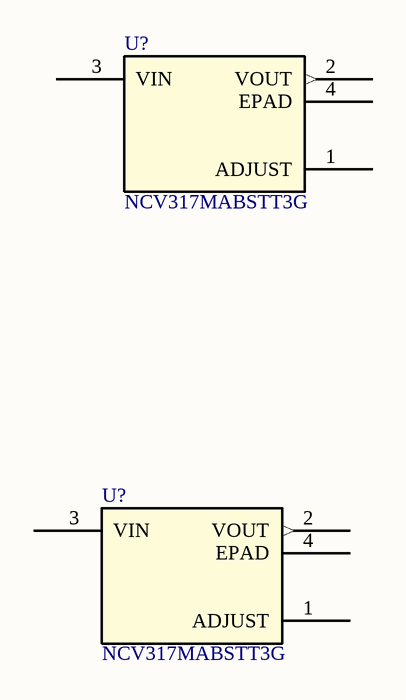
[diagram p18: INT_REG.SchDoc]

### Parts
(Parts that share a designator on the sheet are numbered #1, #2 ... from top to bottom, then left to right.)
U?#1  NCV317MABSTT3G  [NCV317MABSTT3G-Footprint-1]
U?#2  NCV317MABSTT3G  [NCV317MABSTT3G-Footprint-1]

### Nets

Not connected (* = marked no-connect by the designer): U?#1 1(ADJUST) 2(VOUT) 3(VIN) 4(EPAD); U?#2 1(ADJUST) 2(VOUT) 3(VIN) 4(EPAD)

### Library data of the parts
U?#1 U?#2 = CMP-019-00064-1: Linear Voltage Regulator, 0.5 A, Ultra-High PSRR Vout: 4%; TJ = -40°C to 125°C; Output Voltage: 37V; Max Supply Voltage: 40V; Min Supply Voltage: 2.8V; Min Operating Temperature: -40°C; Max Operating Temperature: 125°C; Case/Package: SOT-223-4; Mounting Technology: Surface Mount

## Sheet MCP1726_PINOUT.SchDoc
size A; SheetNumber: 11; SheetTotal: 12
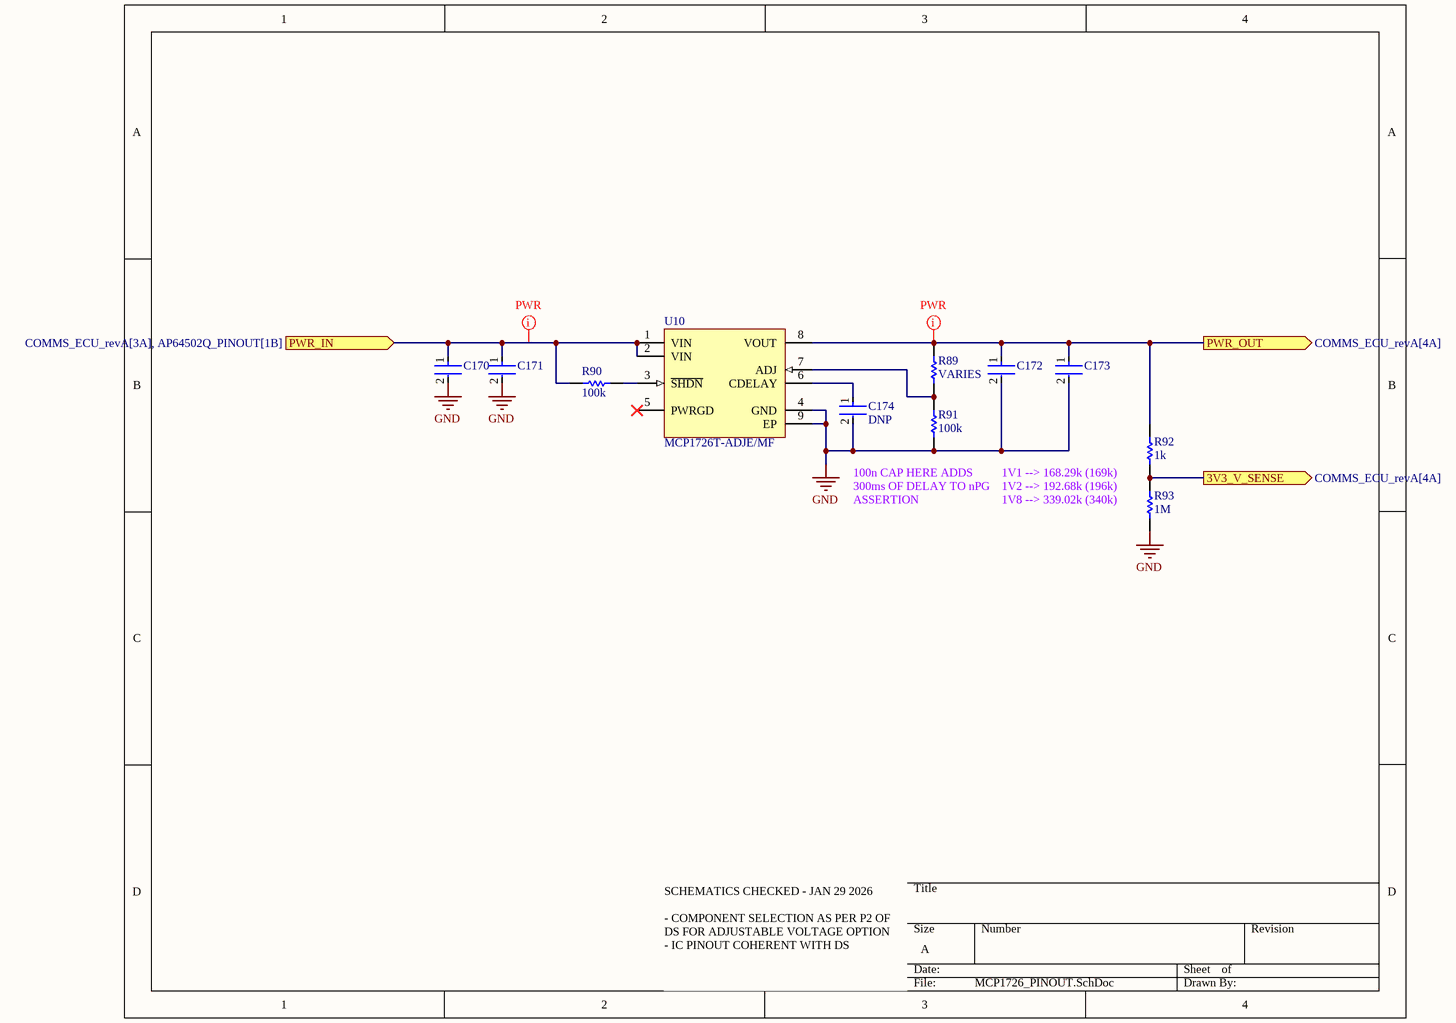
[diagram p19: MCP1726_PINOUT.SchDoc]

### Parts
C170  C0805C475J4RACAUTO  [FP-C0805C475J4RACAUTO-MFG]  (value not drawn)
C171  DNP  [FP-C0805C475J4RACAUTO-MFG]  (value not drawn)
C172  HMK325B7105KN-T  [FP-1210-L_3_2_0_3-W_2_5_0-IPC_B]  (value not drawn)
C173  DNP  [FP-1210-L_3_2_0_3-W_2_5_0-IPC_B]  (value not drawn)
C174  DNP  [FP-0402-L_1_0_0_05-W_0_5-IPC_A]
R89  VARIES  [R0603B]
R90  100k  [R0603B]
R91  100k  [R0603B]
R92  1k  [R0603B]
R93  1M  [R0603B]
U10  MCP1726T-ADJE/MF  [DFN-MF8]

### Ports
3V3_V_SENSE (out, see COMMS_ECU_revA[4A]), PWR_IN (in, see COMMS_ECU_revA[3A], AP64502Q_PINOUT[1B]), PWR_OUT (out, see COMMS_ECU_revA[4A])

### Nets
GND: C170.2 C171.2 C172.2 C173.2 C174.2 R91.1 R93.1 U10.4(GND) U10.9(EP)
NetC170_1: C170.1 C171.1 R90.1 U10.1(VIN) U10.2(VIN) ; port PWR_IN
NetC172_1: C172.1 C173.1 R89.2 R92.2 U10.8(VOUT) ; port PWR_OUT
NetC174_1: C174.1 U10.6(CDELAY)
NetR89_1: R89.1 R91.2 U10.7(ADJ)
NetR90_2: R90.2 U10.3(~{SHDN})
NetR92_1: R92.1 R93.2 ; port 3V3_V_SENSE

Not connected (* = marked no-connect by the designer): U10 5(PWRGD)*

### Layout directives
net class PWR: NetC170_1, NetC172_1

### Notes on the sheet
- (near R91) 100n CAP HERE ADDS 300ms OF DELAY TO nPG ASSERTION
- 1V1 --> 168.29k (169k)
  1V2 --> 192.68k (196k)
  1V8 --> 339.02k (340k)
- SCHEMATICS CHECKED - JAN 29 2026
  - COMPONENT SELECTION AS PER P2 OF DS FOR ADJUSTABLE VOLTAGE OPTION
  - IC PINOUT COHERENT WITH DS

### Library data of the parts
C170 C171 = CMP-00212-84766729-1: C0805C475J4RACAUTO Cap Ceramic 4.7uF 16V X7R 5% Pad SMD 0805 125C Automotive T/R; Capacitance: 4.7µF; Max Operating Temperature: 125°C; Dielectric Material: Ceramic; Voltage Rating (DC): 16V; Dielectric: X7R; Height: 1.4mm; Case/Package: 0805; NexarPartId: 84766729; Voltage Rating: 16V; RoHS: Compliant; Material: Ceramic; Packaging: Cut Tape; Tolerance: 5%; Min Operating Temperature: -55°C
C172 C173 = CMP-14477-002774-2: None; Dielectric: X5R; Capacitance: 1uF; Voltage Rating (DC): 100V; Tolerance: 10%; Length: 3.2mm; Thickness: 0.083inch; Construction: Flat; Width: 2.5mm; Number of Pins: 2; Height: 1.9mm; REACH SVHC: No SVHC; Case Code (Metric): 3225; Termination: SMD/SMT; Packaging: Tape and Reel; Resistor Type: Ceramic; Mount: Surface Mount; Radiation Hardening: No; Case/Package: 1210; Case Code (Imperial): 1210; Min Operating Temperature: -55°C; Max Operating Temperature: 125°C; Halogen Free: Halogen Free; Voltage Rating: 100V; Depth: 2.5mm; Package Quantity: 1; RoHS Compliant: Yes; Voltage: 100V; Series: M
C174 = CMP-001-00058-1: as C138 on sheet INPUT_PWR_SW; Min Operating Temperature: -55°C; Mounting Technology: Surface Mount; Pins: 2; Case/Package: 0402; RoHS Compliant: Yes; Max Operating Temperature: 85°C
R89 R90 R92 R93 = CMP-009-00002-14: Resistor
  R89: Value: VARIES
  R90: Value: 100k
  R92: Value: 1k
  R93: Value: 1M
R91 = CMP-009-00002-14: Resistor; Value: 10k
U10 = CMP-0136-00358-1: 1A, Low Voltage, Low Quiescent Current LDO Regulator, 8-Pin DFN, Extended Temperature, Tape and Reel; DatasheetVersion: revC, Aug-2007; PackageDescription: 8-Lead Plastic Dual Flat, No Lead Package (MF) - 3x3x0.9mm Body [DFN]; PackageVersion: revBB, Aug-2009; PackageReference: DFN-MF8

## Nets that join several sheets
1V1: COMMS_ECU_revA (F?#3.1 F?#4.1), REG_3 (8 pins)
1V2: COMMS_ECU_revA (F?#1.1 F?#2.1), SJA1150Q_PINOUT_0 (6 pins), SJA1150Q_PINOUT_1 (6 pins), REG_2 (8 pins)
3V3: COMMS_ECU_revA (J3.L2 J3.L4 R6.2 R7.2), LAN8830_PINOUT (18 pins), SJA1150Q_PINOUT_0 (42 pins), SJA1150Q_PINOUT_1 (42 pins), PHY_0 (16 pins), PHY_5 (16 pins), PHY_1 (16 pins), PHY_2 (16 pins), PHY_3 (16 pins), PHY_4 (16 pins), 74FCT3807S_PINOUT (12 pins), STM32H730_PINOUT (20 pins), INPUT_PWR_SW (C138.1 U6.8), LM61495Q3_PINOUT (9 pins)
3V3_INT: TCAN1146_0 (C153_TCAN1146_0.1 U8_TCAN1146_0.5), OR_0 (R73_OR_0.2), OR_1 (R73_OR_1.2), TCAN1146_1 (C153_TCAN1146_1.1 U8_TCAN1146_1.5)
3V3_LED: PHY_0 (D6_PHY_0.2 D6_PHY_0.3), PHY_5 (D6_PHY_5.2 D6_PHY_5.3), PHY_1 (D6_PHY_1.2 D6_PHY_1.3), PHY_2 (D6_PHY_2.2 D6_PHY_2.3), PHY_3 (D6_PHY_3.2 D6_PHY_3.3), PHY_4 (D6_PHY_4.2 D6_PHY_4.3)
5V0_INT: TCAN1146_0 (C152_TCAN1146_0.1 U8_TCAN1146_0.3), TCAN1146_1 (C152_TCAN1146_1.1 U8_TCAN1146_1.3)
8870_1V1: PHY_0 (11 pins), PHY_5 (11 pins), PHY_1 (11 pins), PHY_2 (11 pins), PHY_3 (11 pins), PHY_4 (11 pins)
APM_VCC: COMMS_ECU_revA (J2.1 J2.2), OR_1 (6 pins)
CAR_VCC: COMMS_ECU_revA (J2.4 J2.5), OR_0 (6 pins)
GND: COMMS_ECU_revA (16 pins), LAN8830_PINOUT (30 pins), SJA1150Q_PINOUT_0 (96 pins), SJA1150Q_PINOUT_1 (96 pins), PHY_0 (38 pins), PHY_5 (38 pins), PHY_1 (38 pins), PHY_2 (38 pins), PHY_3 (38 pins), PHY_4 (38 pins), 74FCT3807S_PINOUT (13 pins), STM32H730_PINOUT (33 pins), TCAN1146_0 (10 pins), OR_0 (20 pins), OR_1 (20 pins), INPUT_PWR_SW (6 pins), LM61495Q3_PINOUT (16 pins), TCAN1146_1 (10 pins), REG_3 (12 pins), REG_2 (12 pins), MCP1726_PINOUT (9 pins)
PRE_VCC: TCAN1146_0 (D11_TCAN1146_0.2), OR_0 (6 pins), OR_1 (6 pins), INPUT_PWR_SW (7 pins), TCAN1146_1 (D11_TCAN1146_1.2)
SW_VDD_CORE: SJA1150Q_PINOUT_0 (19 pins), SJA1150Q_PINOUT_1 (19 pins)
SW_VDDA_OSC: SJA1150Q_PINOUT_0 (5 pins), SJA1150Q_PINOUT_1 (5 pins)
SW_VDDA_PLL: SJA1150Q_PINOUT_0 (5 pins), SJA1150Q_PINOUT_1 (5 pins)
VCC: INPUT_PWR_SW (R62.2 U6.3 U6.4), LM61495Q3_PINOUT (7 pins), REG_3 (C176.1 C177.1 U11.2 U11.3), REG_2 (C176_REG_2.1 C177_REG_2.1 U11_REG_2.2 U11_REG_2.3)
3V3_LAN8830_CLK: LAN8830_PINOUT (C10.2), 74FCT3807S_PINOUT (R57.2)
3V3_LAN8870_0_CLK: PHY_0 (C34_PHY_0.2), 74FCT3807S_PINOUT (R51.2)
3V3_LAN8870_1_CLK: PHY_1 (C34_PHY_1.2), 74FCT3807S_PINOUT (R52.2)
3V3_LAN8870_2_CLK: PHY_2 (C34_PHY_2.2), 74FCT3807S_PINOUT (R53.2)
3V3_LAN8870_3_CLK: PHY_3 (C34_PHY_3.2), 74FCT3807S_PINOUT (R54.2)
3V3_LAN8870_4_CLK: PHY_4 (C34_PHY_4.2), 74FCT3807S_PINOUT (R55.2)
3V3_LAN8870_5_CLK: PHY_5 (C34_PHY_5.2), 74FCT3807S_PINOUT (R56.2)
3V3_MDC: COMMS_ECU_revA (R7.1), LAN8830_PINOUT (U1.37), PHY_0 (U2_PHY_0.34), PHY_5 (U2_PHY_5.34), PHY_1 (U2_PHY_1.34), PHY_2 (U2_PHY_2.34), PHY_3 (U2_PHY_3.34), PHY_4 (U2_PHY_4.34), STM32H730_PINOUT (U4.16)
3V3_MDIO: COMMS_ECU_revA (R6.1), LAN8830_PINOUT (U1.38), PHY_0 (U2_PHY_0.33), PHY_5 (U2_PHY_5.33), PHY_1 (U2_PHY_1.33), PHY_2 (U2_PHY_2.33), PHY_3 (U2_PHY_3.33), PHY_4 (U2_PHY_4.33), STM32H730_PINOUT (U4.24)
3V3_SJA1105_0_CLK: SJA1150Q_PINOUT_0 (C59_SJA1150Q_PINOUT_0.2), 74FCT3807S_PINOUT (R58.2)
3V3_SJA1105_1_CLK: SJA1150Q_PINOUT_1 (C59_SJA1150Q_PINOUT_1.2), 74FCT3807S_PINOUT (R59.2)
3V3_SJA1150Q_MISO: SJA1150Q_PINOUT_0 (U3_SJA1150Q_PINOUT_0.P4), SJA1150Q_PINOUT_1 (U3_SJA1150Q_PINOUT_1.P4)
3V3_SJA1150Q_MOSI: SJA1150Q_PINOUT_0 (U3_SJA1150Q_PINOUT_0.N5), SJA1150Q_PINOUT_1 (U3_SJA1150Q_PINOUT_1.N5)
3V3_SJA1150Q_SCLK: SJA1150Q_PINOUT_0 (U3_SJA1150Q_PINOUT_0.P5), SJA1150Q_PINOUT_1 (U3_SJA1150Q_PINOUT_1.P5)
3V3_TCAN1146_MISO: TCAN1146_0 (U8_TCAN1146_0.6), TCAN1146_1 (U8_TCAN1146_1.6)
3V3_TCAN1146_MOSI: TCAN1146_0 (U8_TCAN1146_0.11), TCAN1146_1 (U8_TCAN1146_1.11)
3V3_TCAN1146_SCLK: TCAN1146_0 (U8_TCAN1146_0.8), TCAN1146_1 (U8_TCAN1146_1.8)
3V3_TCAN1146_WAKE: COMMS_ECU_revA (Q1.3), TCAN1146_0 (C155_TCAN1146_0.1 R81_TCAN1146_0.1 R82_TCAN1146_0.2 SW3_TCAN1146_0.2)
CAN0_N: COMMS_ECU_revA (J2.11), TCAN1146_0 (C156_TCAN1146_0.1 D12_TCAN1146_0.1 L2_TCAN1146_0.4 R83_TCAN1146_0.2)
CAN0_P: COMMS_ECU_revA (J2.10), TCAN1146_0 (C158_TCAN1146_0.2 D12_TCAN1146_0.2 L2_TCAN1146_0.1 R84_TCAN1146_0.1)
CAN1_N: COMMS_ECU_revA (J2.14), TCAN1146_1 (C156_TCAN1146_1.1 D12_TCAN1146_1.1 L2_TCAN1146_1.4 R83_TCAN1146_1.2)
CAN1_P: COMMS_ECU_revA (J2.13), TCAN1146_1 (C158_TCAN1146_1.2 D12_TCAN1146_1.2 L2_TCAN1146_1.1 R84_TCAN1146_1.1)
HV_PWR_EN: COMMS_ECU_revA (D1.1 D2.1 D3.1 D5.1), OR_0 (U7_OR_0.7), OR_1 (U7_OR_1.7), INPUT_PWR_SW (R65.1)
LAN8830_CLK125_EN: LAN8830_PINOUT (R21.2 U1.34), SJA1150Q_PINOUT_1 (U3_SJA1150Q_PINOUT_1.G14)
LAN8830_MODE0: LAN8830_PINOUT (R17.2 U1.33), SJA1150Q_PINOUT_1 (U3_SJA1150Q_PINOUT_1.J14)
LAN8830_MODE1: LAN8830_PINOUT (R18.2 U1.32), SJA1150Q_PINOUT_1 (U3_SJA1150Q_PINOUT_1.H13)
LAN8830_MODE2: LAN8830_PINOUT (R19.2 U1.30), SJA1150Q_PINOUT_1 (U3_SJA1150Q_PINOUT_1.H14)
LAN8830_MODE3: LAN8830_PINOUT (R20.2 U1.29), SJA1150Q_PINOUT_1 (U3_SJA1150Q_PINOUT_1.G13)
LAN8830_MODE4: LAN8830_PINOUT (R13.2 U1.36), SJA1150Q_PINOUT_1 (U3_SJA1150Q_PINOUT_1.J13)
LAN8830_PHYAD0: COMMS_ECU_revA (R5.1), LAN8830_PINOUT (R10.1 R14.2 U1.18)
LAN8830_PHYAD1: COMMS_ECU_revA (R4.1), LAN8830_PINOUT (R11.2 R15.1 U1.16)
LAN8830_TXRXA_N: COMMS_ECU_revA (J3.P3), LAN8830_PINOUT (U1.3)
LAN8830_TXRXA_P: COMMS_ECU_revA (J3.P2), LAN8830_PINOUT (U1.2)
LAN8830_TXRXB_N: COMMS_ECU_revA (J3.P5), LAN8830_PINOUT (U1.6)
LAN8830_TXRXB_P: COMMS_ECU_revA (J3.P4), LAN8830_PINOUT (U1.5)
LAN8830_TXRXC_N: COMMS_ECU_revA (J3.P8), LAN8830_PINOUT (U1.8)
LAN8830_TXRXC_P: COMMS_ECU_revA (J3.P7), LAN8830_PINOUT (U1.7)
LAN8830_TXRXD_N: COMMS_ECU_revA (J3.P10), LAN8830_PINOUT (U1.11)
LAN8830_TXRXD_P: COMMS_ECU_revA (J3.P9), LAN8830_PINOUT (U1.10)
LAN8870_RX_CLK: SJA1150Q_PINOUT_0 (U3_SJA1150Q_PINOUT_0.B6), PHY_0 (U2_PHY_0.16)
LAN8870_RX_CLK: SJA1150Q_PINOUT_0 (U3_SJA1150Q_PINOUT_0.B14), PHY_1 (U2_PHY_1.16)
LAN8870_RX_CLK: SJA1150Q_PINOUT_0 (U3_SJA1150Q_PINOUT_0.J13), PHY_2 (U2_PHY_2.16)
LAN8870_RX_CLK: SJA1150Q_PINOUT_0 (U3_SJA1150Q_PINOUT_0.P10), PHY_3 (U2_PHY_3.16)
LAN8870_RX_CLK: SJA1150Q_PINOUT_1 (U3_SJA1150Q_PINOUT_1.B6), PHY_4 (U2_PHY_4.16)
LAN8870_RX_CLK: SJA1150Q_PINOUT_1 (U3_SJA1150Q_PINOUT_1.B14), PHY_5 (U2_PHY_5.16)
LAN8870_RXCTL: SJA1150Q_PINOUT_0 (U3_SJA1150Q_PINOUT_0.A4), PHY_0 (R30_PHY_0.2 R37_PHY_0.1 U2_PHY_0.17)
LAN8870_RXCTL: SJA1150Q_PINOUT_0 (U3_SJA1150Q_PINOUT_0.A11), PHY_1 (R30_PHY_1.2 R37_PHY_1.1 U2_PHY_1.17)
LAN8870_RXCTL: SJA1150Q_PINOUT_0 (U3_SJA1150Q_PINOUT_0.G14), PHY_2 (R30_PHY_2.2 R37_PHY_2.1 U2_PHY_2.17)
LAN8870_RXCTL: SJA1150Q_PINOUT_0 (U3_SJA1150Q_PINOUT_0.N12), PHY_3 (R30_PHY_3.2 R37_PHY_3.1 U2_PHY_3.17)
LAN8870_RXCTL: SJA1150Q_PINOUT_1 (U3_SJA1150Q_PINOUT_1.A4), PHY_4 (R30_PHY_4.2 R37_PHY_4.1 U2_PHY_4.17)
LAN8870_RXCTL: SJA1150Q_PINOUT_1 (U3_SJA1150Q_PINOUT_1.A11), PHY_5 (R30_PHY_5.2 R37_PHY_5.1 U2_PHY_5.17)
LAN8870_RXD0: SJA1150Q_PINOUT_0 (U3_SJA1150Q_PINOUT_0.A6), PHY_0 (R35_PHY_0.1 R39_PHY_0.1 U2_PHY_0.11)
LAN8870_RXD0: SJA1150Q_PINOUT_0 (U3_SJA1150Q_PINOUT_0.A13), PHY_1 (R35_PHY_1.1 R39_PHY_1.1 U2_PHY_1.11)
LAN8870_RXD0: SJA1150Q_PINOUT_0 (U3_SJA1150Q_PINOUT_0.J14), PHY_2 (R35_PHY_2.1 R39_PHY_2.1 U2_PHY_2.11)
LAN8870_RXD0: SJA1150Q_PINOUT_0 (U3_SJA1150Q_PINOUT_0.N10), PHY_3 (R35_PHY_3.1 R39_PHY_3.1 U2_PHY_3.11)
LAN8870_RXD0: SJA1150Q_PINOUT_1 (U3_SJA1150Q_PINOUT_1.A6), PHY_4 (R35_PHY_4.1 R39_PHY_4.1 U2_PHY_4.11)
LAN8870_RXD0: SJA1150Q_PINOUT_1 (U3_SJA1150Q_PINOUT_1.A13), PHY_5 (R35_PHY_5.1 R39_PHY_5.1 U2_PHY_5.11)
LAN8870_RXD1: SJA1150Q_PINOUT_0 (U3_SJA1150Q_PINOUT_0.B5), PHY_0 (R32_PHY_0.1 R99_PHY_0.1 U2_PHY_0.12)
LAN8870_RXD1: SJA1150Q_PINOUT_0 (U3_SJA1150Q_PINOUT_0.B12), PHY_1 (R32_PHY_1.1 R99_PHY_1.1 U2_PHY_1.12)
LAN8870_RXD1: SJA1150Q_PINOUT_0 (U3_SJA1150Q_PINOUT_0.H13), PHY_2 (R32_PHY_2.1 R99_PHY_2.1 U2_PHY_2.12)
LAN8870_RXD1: SJA1150Q_PINOUT_0 (U3_SJA1150Q_PINOUT_0.P11), PHY_3 (R32_PHY_3.1 R99_PHY_3.1 U2_PHY_3.12)
LAN8870_RXD1: SJA1150Q_PINOUT_1 (U3_SJA1150Q_PINOUT_1.B5), PHY_4 (R32_PHY_4.1 R99_PHY_4.1 U2_PHY_4.12)
LAN8870_RXD1: SJA1150Q_PINOUT_1 (U3_SJA1150Q_PINOUT_1.B12), PHY_5 (R32_PHY_5.1 R99_PHY_5.1 U2_PHY_5.12)
LAN8870_RXD2: SJA1150Q_PINOUT_0 (U3_SJA1150Q_PINOUT_0.A5), PHY_0 (R31_PHY_0.1 R34_PHY_0.1 U2_PHY_0.14)
LAN8870_RXD2: SJA1150Q_PINOUT_0 (U3_SJA1150Q_PINOUT_0.A12), PHY_1 (R31_PHY_1.1 R34_PHY_1.1 U2_PHY_1.14)
LAN8870_RXD2: SJA1150Q_PINOUT_0 (U3_SJA1150Q_PINOUT_0.H14), PHY_2 (R31_PHY_2.1 R34_PHY_2.1 U2_PHY_2.14)
LAN8870_RXD2: SJA1150Q_PINOUT_0 (U3_SJA1150Q_PINOUT_0.N11), PHY_3 (R31_PHY_3.1 R34_PHY_3.1 U2_PHY_3.14)
LAN8870_RXD2: SJA1150Q_PINOUT_1 (U3_SJA1150Q_PINOUT_1.A5), PHY_4 (R31_PHY_4.1 R34_PHY_4.1 U2_PHY_4.14)
LAN8870_RXD2: SJA1150Q_PINOUT_1 (U3_SJA1150Q_PINOUT_1.A12), PHY_5 (R31_PHY_5.1 R34_PHY_5.1 U2_PHY_5.14)
LAN8870_RXD3: SJA1150Q_PINOUT_0 (U3_SJA1150Q_PINOUT_0.B4), PHY_0 (R41_PHY_0.2 U2_PHY_0.15)
LAN8870_RXD3: SJA1150Q_PINOUT_0 (U3_SJA1150Q_PINOUT_0.B11), PHY_1 (R41_PHY_1.2 U2_PHY_1.15)
LAN8870_RXD3: SJA1150Q_PINOUT_0 (U3_SJA1150Q_PINOUT_0.G13), PHY_2 (R41_PHY_2.2 U2_PHY_2.15)
LAN8870_RXD3: SJA1150Q_PINOUT_0 (U3_SJA1150Q_PINOUT_0.P12), PHY_3 (R41_PHY_3.2 U2_PHY_3.15)
LAN8870_RXD3: SJA1150Q_PINOUT_1 (U3_SJA1150Q_PINOUT_1.B4), PHY_4 (R41_PHY_4.2 U2_PHY_4.15)
LAN8870_RXD3: SJA1150Q_PINOUT_1 (U3_SJA1150Q_PINOUT_1.B11), PHY_5 (R41_PHY_5.2 U2_PHY_5.15)
LAN8870_TX_CLK: SJA1150Q_PINOUT_0 (U3_SJA1150Q_PINOUT_0.A7), PHY_0 (U2_PHY_0.23)
LAN8870_TX_CLK: SJA1150Q_PINOUT_0 (U3_SJA1150Q_PINOUT_0.C14), PHY_1 (U2_PHY_1.23)
LAN8870_TX_CLK: SJA1150Q_PINOUT_0 (U3_SJA1150Q_PINOUT_0.K14), PHY_2 (U2_PHY_2.23)
LAN8870_TX_CLK: SJA1150Q_PINOUT_0 (U3_SJA1150Q_PINOUT_0.N9), PHY_3 (U2_PHY_3.23)
LAN8870_TX_CLK: SJA1150Q_PINOUT_1 (U3_SJA1150Q_PINOUT_1.A7), PHY_4 (U2_PHY_4.23)
LAN8870_TX_CLK: SJA1150Q_PINOUT_1 (U3_SJA1150Q_PINOUT_1.C14), PHY_5 (U2_PHY_5.23)
LAN8870_TX_CTL: SJA1150Q_PINOUT_0 (U3_SJA1150Q_PINOUT_0.B7), PHY_0 (U2_PHY_0.24)
LAN8870_TX_CTL: SJA1150Q_PINOUT_0 (U3_SJA1150Q_PINOUT_0.C13), PHY_1 (U2_PHY_1.24)
LAN8870_TX_CTL: SJA1150Q_PINOUT_0 (U3_SJA1150Q_PINOUT_0.K13), PHY_2 (U2_PHY_2.24)
LAN8870_TX_CTL: SJA1150Q_PINOUT_0 (U3_SJA1150Q_PINOUT_0.P9), PHY_3 (U2_PHY_3.24)
LAN8870_TX_CTL: SJA1150Q_PINOUT_1 (U3_SJA1150Q_PINOUT_1.B7), PHY_4 (U2_PHY_4.24)
LAN8870_TX_CTL: SJA1150Q_PINOUT_1 (U3_SJA1150Q_PINOUT_1.C13), PHY_5 (U2_PHY_5.24)
LAN8870_TXD0: SJA1150Q_PINOUT_0 (U3_SJA1150Q_PINOUT_0.B9), PHY_0 (U2_PHY_0.25)
LAN8870_TXD0: SJA1150Q_PINOUT_0 (U3_SJA1150Q_PINOUT_0.E13), PHY_1 (U2_PHY_1.25)
LAN8870_TXD0: SJA1150Q_PINOUT_0 (U3_SJA1150Q_PINOUT_0.M13), PHY_2 (U2_PHY_2.25)
LAN8870_TXD0: SJA1150Q_PINOUT_0 (U3_SJA1150Q_PINOUT_0.P7), PHY_3 (U2_PHY_3.25)
LAN8870_TXD0: SJA1150Q_PINOUT_1 (U3_SJA1150Q_PINOUT_1.B9), PHY_4 (U2_PHY_4.25)
LAN8870_TXD0: SJA1150Q_PINOUT_1 (U3_SJA1150Q_PINOUT_1.E13), PHY_5 (U2_PHY_5.25)
LAN8870_TXD1: SJA1150Q_PINOUT_0 (U3_SJA1150Q_PINOUT_0.A9), PHY_0 (U2_PHY_0.26)
LAN8870_TXD1: SJA1150Q_PINOUT_0 (U3_SJA1150Q_PINOUT_0.E14), PHY_1 (U2_PHY_1.26)
LAN8870_TXD1: SJA1150Q_PINOUT_0 (U3_SJA1150Q_PINOUT_0.M14), PHY_2 (U2_PHY_2.26)
LAN8870_TXD1: SJA1150Q_PINOUT_0 (U3_SJA1150Q_PINOUT_0.N7), PHY_3 (U2_PHY_3.26)
LAN8870_TXD1: SJA1150Q_PINOUT_1 (U3_SJA1150Q_PINOUT_1.A9), PHY_4 (U2_PHY_4.26)
LAN8870_TXD1: SJA1150Q_PINOUT_1 (U3_SJA1150Q_PINOUT_1.E14), PHY_5 (U2_PHY_5.26)
LAN8870_TXD2: SJA1150Q_PINOUT_0 (U3_SJA1150Q_PINOUT_0.B8), PHY_0 (U2_PHY_0.27)
LAN8870_TXD2: SJA1150Q_PINOUT_0 (U3_SJA1150Q_PINOUT_0.D13), PHY_1 (U2_PHY_1.27)
LAN8870_TXD2: SJA1150Q_PINOUT_0 (U3_SJA1150Q_PINOUT_0.L13), PHY_2 (U2_PHY_2.27)
LAN8870_TXD2: SJA1150Q_PINOUT_0 (U3_SJA1150Q_PINOUT_0.P8), PHY_3 (U2_PHY_3.27)
LAN8870_TXD2: SJA1150Q_PINOUT_1 (U3_SJA1150Q_PINOUT_1.B8), PHY_4 (U2_PHY_4.27)
LAN8870_TXD2: SJA1150Q_PINOUT_1 (U3_SJA1150Q_PINOUT_1.D13), PHY_5 (U2_PHY_5.27)
LAN8870_TXD3: SJA1150Q_PINOUT_0 (U3_SJA1150Q_PINOUT_0.A8), PHY_0 (U2_PHY_0.28)
LAN8870_TXD3: SJA1150Q_PINOUT_0 (U3_SJA1150Q_PINOUT_0.D14), PHY_1 (U2_PHY_1.28)
LAN8870_TXD3: SJA1150Q_PINOUT_0 (U3_SJA1150Q_PINOUT_0.L14), PHY_2 (U2_PHY_2.28)
LAN8870_TXD3: SJA1150Q_PINOUT_0 (U3_SJA1150Q_PINOUT_0.N8), PHY_3 (U2_PHY_3.28)
LAN8870_TXD3: SJA1150Q_PINOUT_1 (U3_SJA1150Q_PINOUT_1.A8), PHY_4 (U2_PHY_4.28)
LAN8870_TXD3: SJA1150Q_PINOUT_1 (U3_SJA1150Q_PINOUT_1.D14), PHY_5 (U2_PHY_5.28)
NetD1_2: COMMS_ECU_revA (D1.2), TCAN1146_0 (U8_TCAN1146_0.7)
NetD2_2: COMMS_ECU_revA (D2.2), TCAN1146_1 (U8_TCAN1146_1.7)
NetU1_19: LAN8830_PINOUT (U1.19), SJA1150Q_PINOUT_1 (U3_SJA1150Q_PINOUT_1.M13)
NetU1_20: LAN8830_PINOUT (U1.20), SJA1150Q_PINOUT_1 (U3_SJA1150Q_PINOUT_1.M14)
NetU1_21: LAN8830_PINOUT (U1.21), SJA1150Q_PINOUT_1 (U3_SJA1150Q_PINOUT_1.L13)
NetU1_22: LAN8830_PINOUT (U1.22), SJA1150Q_PINOUT_1 (U3_SJA1150Q_PINOUT_1.L14)
NetU1_25: LAN8830_PINOUT (U1.25), SJA1150Q_PINOUT_1 (U3_SJA1150Q_PINOUT_1.K14)
NetU1_26: LAN8830_PINOUT (U1.26), SJA1150Q_PINOUT_1 (U3_SJA1150Q_PINOUT_1.K13)
NetU3_SJA1150Q_PINOUT_0_A2: SJA1150Q_PINOUT_0 (U3_SJA1150Q_PINOUT_0.A2), SJA1150Q_PINOUT_1 (U3_SJA1150Q_PINOUT_1.E1)
NetU3_SJA1150Q_PINOUT_0_B1: SJA1150Q_PINOUT_0 (U3_SJA1150Q_PINOUT_0.B1), SJA1150Q_PINOUT_1 (U3_SJA1150Q_PINOUT_1.F2)
NetU3_SJA1150Q_PINOUT_0_C1: SJA1150Q_PINOUT_0 (U3_SJA1150Q_PINOUT_0.C1), SJA1150Q_PINOUT_1 (U3_SJA1150Q_PINOUT_1.G2)
NetU3_SJA1150Q_PINOUT_0_C2: SJA1150Q_PINOUT_0 (U3_SJA1150Q_PINOUT_0.C2), SJA1150Q_PINOUT_1 (U3_SJA1150Q_PINOUT_1.F1)
NetU3_SJA1150Q_PINOUT_0_D1: SJA1150Q_PINOUT_0 (U3_SJA1150Q_PINOUT_0.D1), SJA1150Q_PINOUT_1 (U3_SJA1150Q_PINOUT_1.E2)
NetU3_SJA1150Q_PINOUT_0_D2: SJA1150Q_PINOUT_0 (U3_SJA1150Q_PINOUT_0.D2), SJA1150Q_PINOUT_1 (U3_SJA1150Q_PINOUT_1.G1)
NetU3_SJA1150Q_PINOUT_0_E1: SJA1150Q_PINOUT_0 (U3_SJA1150Q_PINOUT_0.E1), SJA1150Q_PINOUT_1 (U3_SJA1150Q_PINOUT_1.A2)
NetU3_SJA1150Q_PINOUT_0_E2: SJA1150Q_PINOUT_0 (U3_SJA1150Q_PINOUT_0.E2), SJA1150Q_PINOUT_1 (U3_SJA1150Q_PINOUT_1.D1)
NetU3_SJA1150Q_PINOUT_0_F1: SJA1150Q_PINOUT_0 (U3_SJA1150Q_PINOUT_0.F1), SJA1150Q_PINOUT_1 (U3_SJA1150Q_PINOUT_1.C2)
NetU3_SJA1150Q_PINOUT_0_F2: SJA1150Q_PINOUT_0 (U3_SJA1150Q_PINOUT_0.F2), SJA1150Q_PINOUT_1 (U3_SJA1150Q_PINOUT_1.B1)
NetU3_SJA1150Q_PINOUT_0_G1: SJA1150Q_PINOUT_0 (U3_SJA1150Q_PINOUT_0.G1), SJA1150Q_PINOUT_1 (U3_SJA1150Q_PINOUT_1.D2)
NetU3_SJA1150Q_PINOUT_0_G2: SJA1150Q_PINOUT_0 (U3_SJA1150Q_PINOUT_0.G2), SJA1150Q_PINOUT_1 (U3_SJA1150Q_PINOUT_1.C1)
NetU3_SJA1150Q_PINOUT_0_N4: SJA1150Q_PINOUT_0 (U3_SJA1150Q_PINOUT_0.N4), SJA1150Q_PINOUT_1 (U3_SJA1150Q_PINOUT_1.N4)
NetU3_SJA1150Q_PINOUT_1_N7: SJA1150Q_PINOUT_1 (U3_SJA1150Q_PINOUT_1.N7), STM32H730_PINOUT (U4.52)
NetU3_SJA1150Q_PINOUT_1_N8: SJA1150Q_PINOUT_1 (U3_SJA1150Q_PINOUT_1.N8), STM32H730_PINOUT (U4.1)
NetU3_SJA1150Q_PINOUT_1_N9: SJA1150Q_PINOUT_1 (U3_SJA1150Q_PINOUT_1.N9), STM32H730_PINOUT (U4.18)
NetU3_SJA1150Q_PINOUT_1_N10: SJA1150Q_PINOUT_1 (U3_SJA1150Q_PINOUT_1.N10), STM32H730_PINOUT (U4.32)
NetU3_SJA1150Q_PINOUT_1_N11: SJA1150Q_PINOUT_1 (U3_SJA1150Q_PINOUT_1.N11), STM32H730_PINOUT (U4.34)
NetU3_SJA1150Q_PINOUT_1_N12: SJA1150Q_PINOUT_1 (U3_SJA1150Q_PINOUT_1.N12), STM32H730_PINOUT (U4.31)
NetU3_SJA1150Q_PINOUT_1_P7: SJA1150Q_PINOUT_1 (U3_SJA1150Q_PINOUT_1.P7), STM32H730_PINOUT (U4.51)
NetU3_SJA1150Q_PINOUT_1_P8: SJA1150Q_PINOUT_1 (U3_SJA1150Q_PINOUT_1.P8), STM32H730_PINOUT (U4.17)
NetU3_SJA1150Q_PINOUT_1_P9: SJA1150Q_PINOUT_1 (U3_SJA1150Q_PINOUT_1.P9), STM32H730_PINOUT (U4.47)
NetU3_SJA1150Q_PINOUT_1_P10: SJA1150Q_PINOUT_1 (U3_SJA1150Q_PINOUT_1.P10), STM32H730_PINOUT (U4.23)
NetU3_SJA1150Q_PINOUT_1_P11: SJA1150Q_PINOUT_1 (U3_SJA1150Q_PINOUT_1.P11), STM32H730_PINOUT (U4.33)
NetU3_SJA1150Q_PINOUT_1_P12: SJA1150Q_PINOUT_1 (U3_SJA1150Q_PINOUT_1.P12), STM32H730_PINOUT (U4.35)
P0_TRX_N: COMMS_ECU_revA (J1.6-2), PHY_0 (C32_PHY_0.2 R23_PHY_0.2)
P0_TRX_P: COMMS_ECU_revA (J1.6-1), PHY_0 (C31_PHY_0.2 R24_PHY_0.2)
P1_TRX_N: COMMS_ECU_revA (J1.1-2), PHY_1 (C32_PHY_1.2 R23_PHY_1.2)
P1_TRX_P: COMMS_ECU_revA (J1.1-1), PHY_1 (C31_PHY_1.2 R24_PHY_1.2)
P2_TRX_N: COMMS_ECU_revA (J1.5-2), PHY_2 (C32_PHY_2.2 R23_PHY_2.2)
P2_TRX_P: COMMS_ECU_revA (J1.5-1), PHY_2 (C31_PHY_2.2 R24_PHY_2.2)
P3_TRX_N: COMMS_ECU_revA (J1.2-2), PHY_3 (C32_PHY_3.2 R23_PHY_3.2)
P3_TRX_P: COMMS_ECU_revA (J1.2-1), PHY_3 (C31_PHY_3.2 R24_PHY_3.2)
P4_TRX_N: COMMS_ECU_revA (J1.3-2), PHY_4 (C32_PHY_4.2 R23_PHY_4.2)
P4_TRX_P: COMMS_ECU_revA (J1.3-1), PHY_4 (C31_PHY_4.2 R24_PHY_4.2)
P5_TRX_N: COMMS_ECU_revA (J1.4-2), PHY_5 (C32_PHY_5.2 R23_PHY_5.2)
P5_TRX_P: COMMS_ECU_revA (J1.4-1), PHY_5 (C31_PHY_5.2 R24_PHY_5.2)